# EAGLE design Dual Analogue Frequency Shifter (EAGLE 9.5.2)

## Sheet 1 of 3
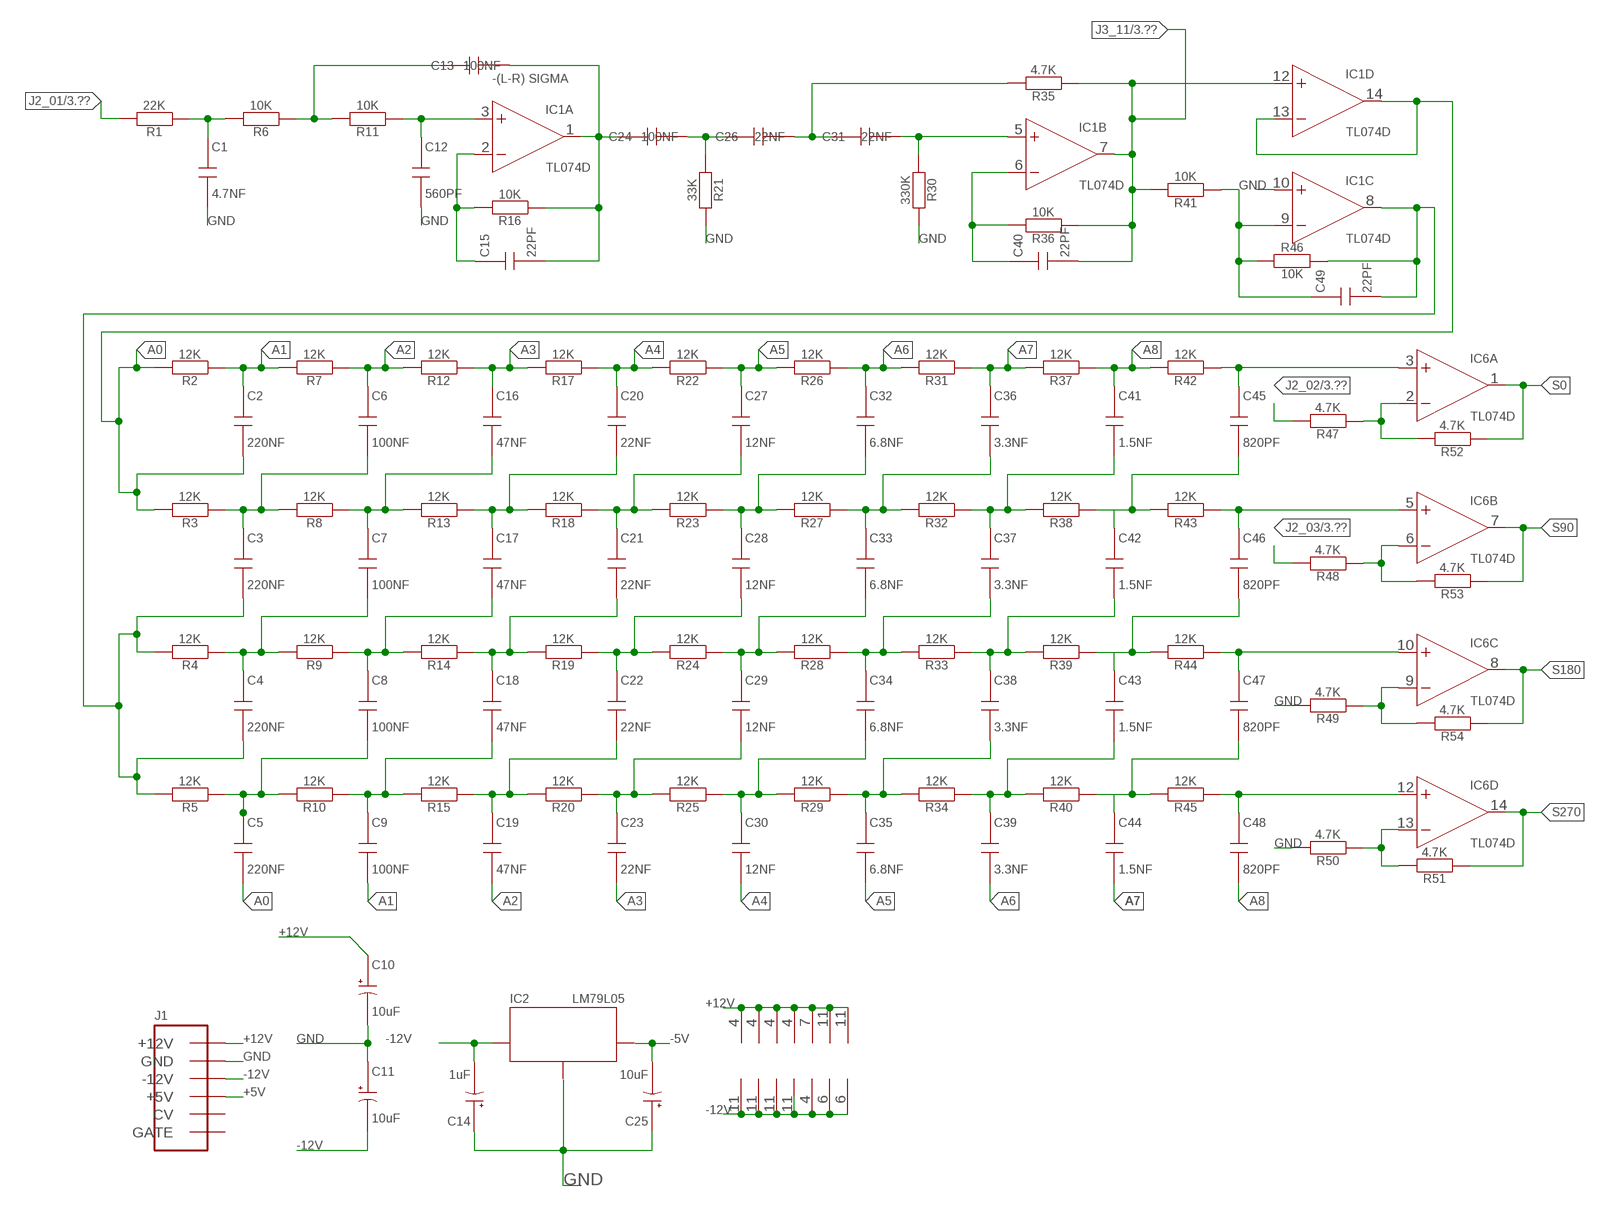
[diagram p0: schematic, sheet 1]

### Parts
C1  4.7NF  C  [CT6032]
C2  220NF  C  [CT6032]
C3  220NF  C  [CT6032]
C4  220NF  C  [CT6032]
C5  220NF  C  [CT6032]
C6  100NF  C  [CT6032]
C7  100NF  C  [CT6032]
C8  100NF  C  [CT6032]
C9  100NF  C  [CT6032]
C10  10uF  C+  [PANASONIC_E]
C11  10uF  C+  [PANASONIC_E]
C12  560PF  C  [CT6032]
C13  100NF  C  [CT6032]
C14  1uF  C+  [PANASONIC_E]
C15  22PF  C  [CT6032]
C16  47NF  C  [CT6032]
C17  47NF  C  [CT6032]
C18  47NF  C  [CT6032]
C19  47NF  C  [CT6032]
C20  22NF  C  [CT6032]
C21  22NF  C  [CT6032]
C22  22NF  C  [CT6032]
C23  22NF  C  [CT6032]
C24  100NF  C  [CT6032]
C25  10uF  C+  [PANASONIC_E]
C26  22NF  C  [CT6032]
C27  12NF  C  [CT6032]
C28  12NF  C  [CT6032]
C29  12NF  C  [CT6032]
C30  12NF  C  [CT6032]
C31  22NF  C  [CT6032]
C32  6.8NF  C  [CT6032]
C33  6.8NF  C  [CT6032]
C34  6.8NF  C  [CT6032]
C35  6.8NF  C  [CT6032]
C36  3.3NF  C  [CT6032]
C37  3.3NF  C  [CT6032]
C38  3.3NF  C  [CT6032]
C39  3.3NF  C  [CT6032]
C40  22PF  C  [CT6032]
C41  1.5NF  C  [CT6032]
C42  1.5NF  C  [CT6032]
C43  1.5NF  C  [CT6032]
C44  1.5NF  C  [CT6032]
C45  820PF  C  [CT6032]
C46  820PF  C  [CT6032]
C47  820PF  C  [CT6032]
C48  820PF  C  [CT6032]
C49  22PF  C  [CT6032]
IC1  TL074D  [SO14]
IC2  LM79L05  VREG  [SO08]
IC3  OPA4277U  [SO14]
IC4  TL074D  [SO14]
IC5  OP1177  [SO08]
IC6  TL074D  [SO14]
IC7  LM13700  [SO16]
IC8  LM13700  [SO16]
J1  EURO  [2X08SMT]
R1  22K  R  [R6332W]
R2  12K  R  [R6332W]
R3  12K  R  [R6332W]
R4  12K  R  [R6332W]
R5  12K  R  [R6332W]
R6  10K  R  [R6332W]
R7  12K  R  [R6332W]
R8  12K  R  [R6332W]
R9  12K  R  [R6332W]
R10  12K  R  [R6332W]
R11  10K  R  [R6332W]
R12  12K  R  [R6332W]
R13  12K  R  [R6332W]
R14  12K  R  [R6332W]
R15  12K  R  [R6332W]
R16  10K  R  [R6332W]
R17  12K  R  [R6332W]
R18  12K  R  [R6332W]
R19  12K  R  [R6332W]
R20  12K  R  [R6332W]
R21  33K  R  [R6332W]
R22  12K  R  [R6332W]
R23  12K  R  [R6332W]
R24  12K  R  [R6332W]
R25  12K  R  [R6332W]
R26  12K  R  [R6332W]
R27  12K  R  [R6332W]
R28  12K  R  [R6332W]
R29  12K  R  [R6332W]
R30  330K  R  [R6332W]
R31  12K  R  [R6332W]
R32  12K  R  [R6332W]
R33  12K  R  [R6332W]
R34  12K  R  [R6332W]
R35  4.7K  R  [R6332W]
R36  10K  R  [R6332W]
R37  12K  R  [R6332W]
R38  12K  R  [R6332W]
R39  12K  R  [R6332W]
R40  12K  R  [R6332W]
R41  10K  R  [R6332W]
R42  12K  R  [R6332W]
R43  12K  R  [R6332W]
R44  12K  R  [R6332W]
R45  12K  R  [R6332W]
R46  10K  R  [R6332W]
R47  4.7K  R  [R6332W]
R48  4.7K  R  [R6332W]
R49  4.7K  R  [R6332W]
R50  4.7K  R  [R6332W]
R51  4.7K  R  [R6332W]
R52  4.7K  R  [R6332W]
R53  4.7K  R  [R6332W]
R54  4.7K  R  [R6332W]

### Nets
+5V: J1.11(+5V) J1.12(+5V) ; also sheet 2,3
+12V: C10.+ IC1.4(P:V+) IC3.4(E:V+) IC4.4(P:V+) IC5.7(B:V+) IC6.4(P:V+) IC7.11(V+) IC8.11(V+) J1.9(+12V) J1.10(+12V) ; also sheet 3
-5V: C25.- IC2.1(OUT) ; also sheet 3
-12V: C11.- C14.- IC1.11(P:V-) IC2.8(IN) IC3.11(E:V-) IC4.11(P:V-) IC5.4(B:V-) IC6.11(P:V-) IC7.6(V-) IC8.6(V-) J1.1(-12V) J1.2(-12V) ; also sheet 3
A0: C2.- C5.- IC1.13(D:-IN) IC1.14(D:OUT) R2.2 R3.2
A1: C2.+ C9.- R2.1 R7.2
A2: C6.+ C19.- R7.1 R12.2
A3: C16.+ C23.- R12.1 R17.2
A4: C20.+ C30.- R17.1 R22.2
A5: C27.+ C35.- R22.1 R26.2
A6: C32.+ C39.- R26.1 R31.2
A7: C36.+ C44.- R31.1 R37.2
A8: C41.+ C48.- R37.1 R42.2
GND: C1.- C10.- C11.+ C12.- C14.+ C25.+ IC1.10(C:+IN) IC2.2(GND) IC2.3(GND) IC2.6(GND) IC2.7(GND) J1.3(GND) J1.4(GND) J1.5(GND) J1.6(GND) J1.7(GND) J1.8(GND) R21.2 R30.2 R49.2 R50.2 ; also sheet 2,3
J2_01: R1.2 ; also sheet 3
J2_02: R47.2 ; also sheet 3
J2_03: R48.2 ; also sheet 3
J3_11: C40.- IC1.7(B:OUT) IC1.12(D:+IN) R35.1 R36.1 R41.2 ; also sheet 3
N$6: C35.+ C38.- R29.1 R34.2
N$38: C3.+ C6.- R3.1 R8.2
N$39: C7.+ C16.- R8.1 R13.2
N$40: C17.+ C20.- R13.1 R18.2
N$41: C21.+ C27.- R18.1 R23.2
N$42: C28.+ C32.- R23.1 R27.2
N$43: C33.+ C36.- R27.1 R32.2
N$44: C37.+ C41.- R32.1 R38.2
N$45: C4.+ C7.- R4.1 R9.2
N$46: C8.+ C17.- R9.1 R14.2
N$47: C18.+ C21.- R14.1 R19.2
N$48: C22.+ C28.- R19.1 R24.2
N$49: C29.+ C33.- R24.1 R28.2
N$50: C34.+ C37.- R28.1 R33.2
N$51: C38.+ C42.- R33.1 R39.2
N$52: C5.+ C8.- R5.1 R10.2
N$53: C9.+ C18.- R10.1 R15.2
N$54: C19.+ C22.- R15.1 R20.2
N$55: C23.+ C29.- R20.1 R25.2
N$56: C30.+ C34.- R25.1 R29.2
N$58: C39.+ C43.- R34.1 R40.2
N$68: C1.+ R1.1 R6.2
N$69: C13.+ R6.1 R11.2
N$70: C12.+ IC1.3(A:+IN) R11.1
N$71: C31.- IC1.5(B:+IN) R30.1
N$72: C13.- C15.- C24.+ IC1.1(A:OUT) R16.1
N$73: C15.+ IC1.2(A:-IN) R16.2
N$74: C24.- C26.+ R21.1
N$75: IC6.2(A:-IN) R47.1 R52.2
N$77: C3.- C4.- C49.- IC1.8(C:OUT) R4.2 R5.2 R46.2
N$118: IC6.6(B:-IN) R48.1 R53.2
N$132: C49.+ IC1.9(C:-IN) R41.1 R46.1
N$153: C26.- C31.+ R35.2
N$154: C42.+ C45.- R38.1 R43.2
N$155: IC6.9(C:-IN) R49.1 R54.2
N$156: C43.+ C46.- R39.1 R44.2
N$157: IC6.13(D:-IN) R50.1 R51.2
N$158: C40.+ IC1.6(B:-IN) R36.2
N$159: C44.+ C47.- R40.1 R45.2
N$162: C45.+ IC6.3(A:+IN) R42.1
N$165: C46.+ IC6.5(B:+IN) R43.1
N$166: C48.+ IC6.12(D:+IN) R45.1
N$167: C47.+ IC6.10(C:+IN) R44.1
S0: IC6.1(A:OUT) R52.1
S90: IC6.7(B:OUT) R53.1
S180: IC6.8(C:OUT) R54.1
S270: IC6.14(D:OUT) R51.1
Unconnected: IC5.5(D:NC) IC5.8(E:NC) J1.13(CV) J1.14(CV) J1.15(GATE) J1.16(GATE)

### Notes on the sheet
- -(L-R) SIGMA

## Sheet 2 of 3
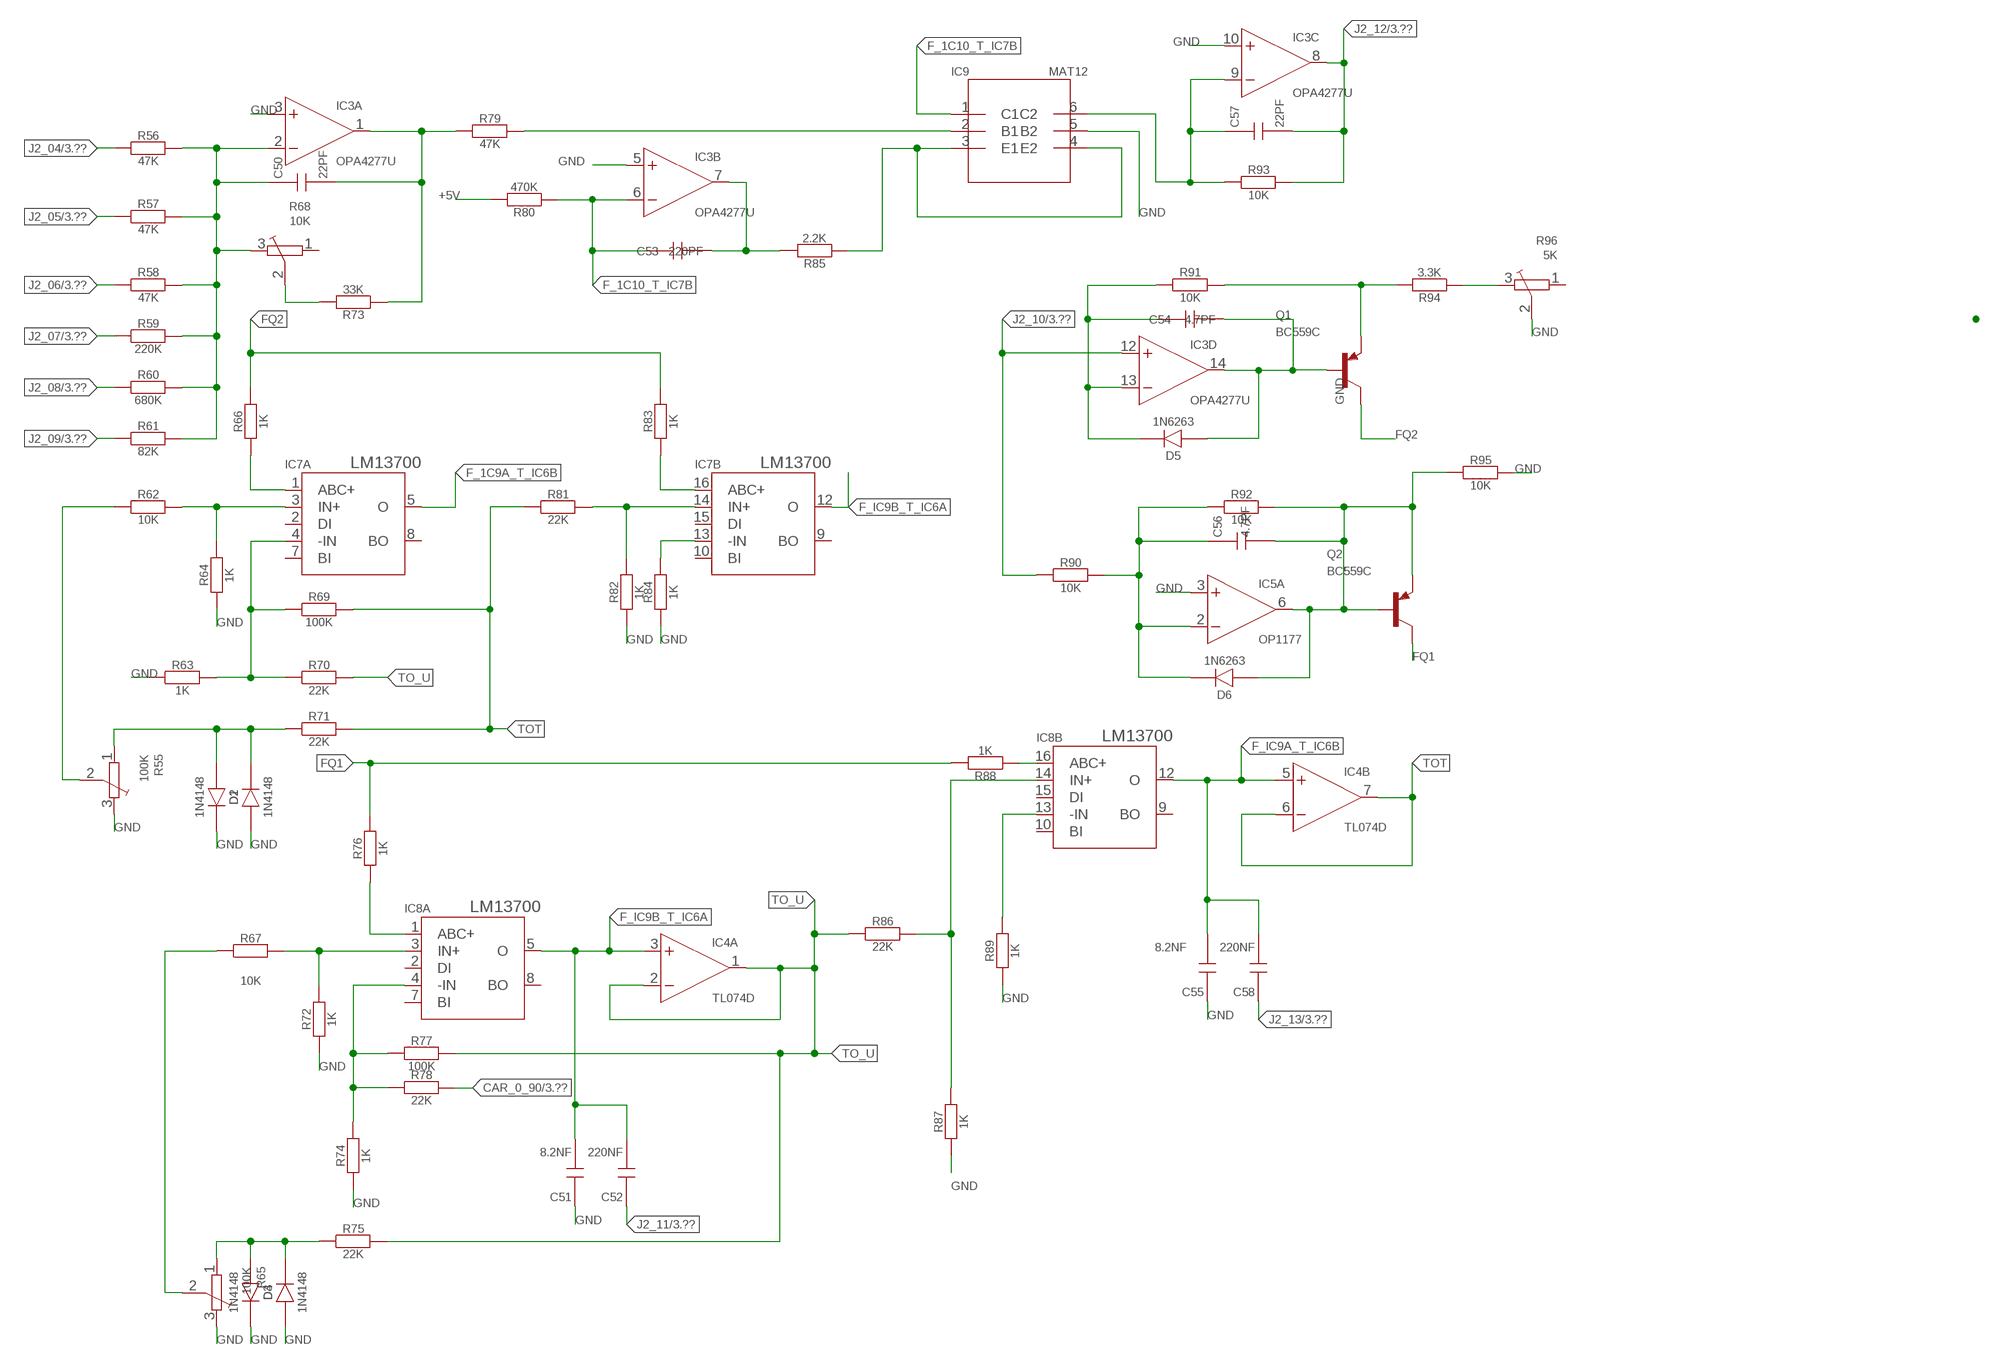
[diagram p1: schematic, sheet 2]

### Parts
C50  22PF  C  [CT6032]
C51  8.2NF  C  [CT6032]
C52  220NF  C  [CT6032]
C53  220PF  C  [CT6032]
C54  4.7PF  C  [CT6032]
C55  8.2NF  C  [CT6032]
C56  4.7PF  C  [CT6032]
C57  22PF  C  [CT6032]
C58  220NF  C  [CT6032]
D1  1N4148  D  [SOD123]
D2  1N4148  D  [SOD123]
D3  1N4148  D  [SOD123]
D4  1N4148  D  [SOD123]
D5  1N6263  D  [SOD123]
D6  1N6263  D  [SOD123]
IC9  MAT12  [H_6]
Q1  BC559C  [TO92]
Q2  BC559C  [TO92]
R55  100K  TRIM  [TRIM]
R56  47K  R  [R6332W]
R57  47K  R  [R6332W]
R58  47K  R  [R6332W]
R59  220K  R  [R6332W]
R60  680K  R  [R6332W]
R61  82K  R  [R6332W]
R62  10K  R  [R6332W]
R63  1K  R  [R6332W]
R64  1K  R  [R6332W]
R65  100K  TRIM  [TRIM]
R66  1K  R  [R6332W]
R67  10K  R  [R6332W]
R68  10K  TRIM  [TRIM]
R69  100K  R  [R6332W]
R70  22K  R  [R6332W]
R71  22K  R  [R6332W]
R72  1K  R  [R6332W]
R73  33K  R  [R6332W]
R74  1K  R  [R6332W]
R75  22K  R  [R6332W]
R76  1K  R  [R6332W]
R77  100K  R  [R6332W]
R78  22K  R  [R6332W]
R79  47K  R  [R6332W]
R80  470K  R  [R6332W]
R81  22K  R  [R6332W]
R82  1K  R  [R6332W]
R83  1K  R  [R6332W]
R84  1K  R  [R6332W]
R85  2.2K  R  [R6332W]
R86  22K  R  [R6332W]
R87  1K  R  [R6332W]
R88  1K  R  [R6332W]
R89  1K  R  [R6332W]
R90  10K  R  [R6332W]
R91  10K  R  [R6332W]
R92  10K  R  [R6332W]
R93  10K  R  [R6332W]
R94  3.3K  R  [R6332W]
R95  10K  R  [R6332W]
R96  5K  TRIM  [TRIM]

### Nets
+5V: R80.2 ; also sheet 1,3
CAR_0_90: R78.2 ; also sheet 3
F_1C9A_T_IC6B: IC7.5(A:O)
F_1C10_T_IC7B: C53.+ IC3.6(B:-IN) IC9.1(C1) R80.1
F_IC9A_T_IC6B: C55.- C58.- IC4.5(B:+IN) IC8.12(B:O)
F_IC9B_T_IC6A: C51.- C52.- IC4.3(A:+IN) IC7.12(B:O) IC8.5(A:O)
FQ1: Q2.C R76.2 R88.2
FQ2: Q1.C R66.2 R83.2
GND: C51.+ C55.+ D1.C D2.A D3.C D4.A IC3.3(A:+IN) IC3.5(B:+IN) IC3.10(C:+IN) IC5.3(A:+IN) IC9.5(B2) R55.3 R63.1 R64.1 R65.3 R72.1 R74.1 R82.1 R84.1 R87.1 R89.1 R95.2 R96.2 ; also sheet 1,3
J2_04: R56.1 ; also sheet 3
J2_05: R57.1 ; also sheet 3
J2_06: R58.1 ; also sheet 3
J2_07: R59.1 ; also sheet 3
J2_08: R60.1 ; also sheet 3
J2_09: R61.1 ; also sheet 3
J2_10: IC3.12(D:+IN) R90.1 ; also sheet 3
J2_11: C52.+ ; also sheet 3
J2_12: C57.- IC3.8(C:OUT) R93.2 ; also sheet 3
J2_13: C58.+ ; also sheet 3
N$3: R94.1 R96.3
N$64: IC9.3(E1) IC9.4(E2) R85.1
N$114: C50.+ IC3.2(A:-IN) R56.2 R57.2 R58.2 R59.2 R60.2 R61.2 R68.3
N$115: C50.- IC3.1(A:OUT) R73.1 R79.1
N$117: C53.- IC3.7(B:OUT) R85.2
N$119: IC9.2(B1) R79.2
N$120: C57.+ IC3.9(C:-IN) IC9.6(C2) R93.1
N$121: C54.+ D5.C IC3.13(D:-IN) R91.1
N$122: C54.- D5.A IC3.14(D:OUT) Q1.B
N$123: Q1.E R91.2 R94.2
N$124: C56.+ D6.C IC5.2(A:-IN) R90.2 R92.1
N$125: C56.- D6.A IC5.6(A:OUT) Q2.B Q2.E R92.2 R95.1
N$126: D3.A D4.C R65.1 R75.1
N$127: IC8.3(A:IN+) R67.2 R72.2
N$129: IC8.1(A:ABC+) R76.1
N$130: IC8.4(A:-IN) R74.2 R77.1 R78.1
N$134: IC8.16(B:ABC+) R88.1
N$135: IC8.14(B:IN+) R86.2 R87.2
N$137: IC8.13(B:-IN) R89.2
N$138: IC7.3(A:IN+) R62.2 R64.2
N$139: IC7.4(A:-IN) R63.2 R69.1 R70.1
N$141: IC7.1(A:ABC+) R66.1
N$142: IC7.16(B:ABC+) R83.1
N$144: IC7.13(B:-IN) R84.2
N$146: IC7.14(B:IN+) R81.2 R82.2
N$147: D1.A D2.C R55.1 R71.1
N$149: R68.2 R73.2
N$151: R65.2 R67.1
N$152: R55.2 R62.1
TO_U: IC4.1(A:OUT) IC4.2(A:-IN) R70.2 R75.2 R77.2 R86.1
TOT: IC4.6(B:-IN) IC4.7(B:OUT) R69.2 R71.2 R81.1
Unconnected: IC5.1(C:NC) IC7.2(A:DI) IC7.7(A:BI) IC7.8(A:BO) IC7.9(B:BO) IC7.10(B:BI) IC7.15(B:DI) IC8.2(A:DI) IC8.7(A:BI) IC8.8(A:BO) IC8.9(B:BO) IC8.10(B:BI) IC8.15(B:DI) R68.1 R96.1

## Sheet 3 of 3
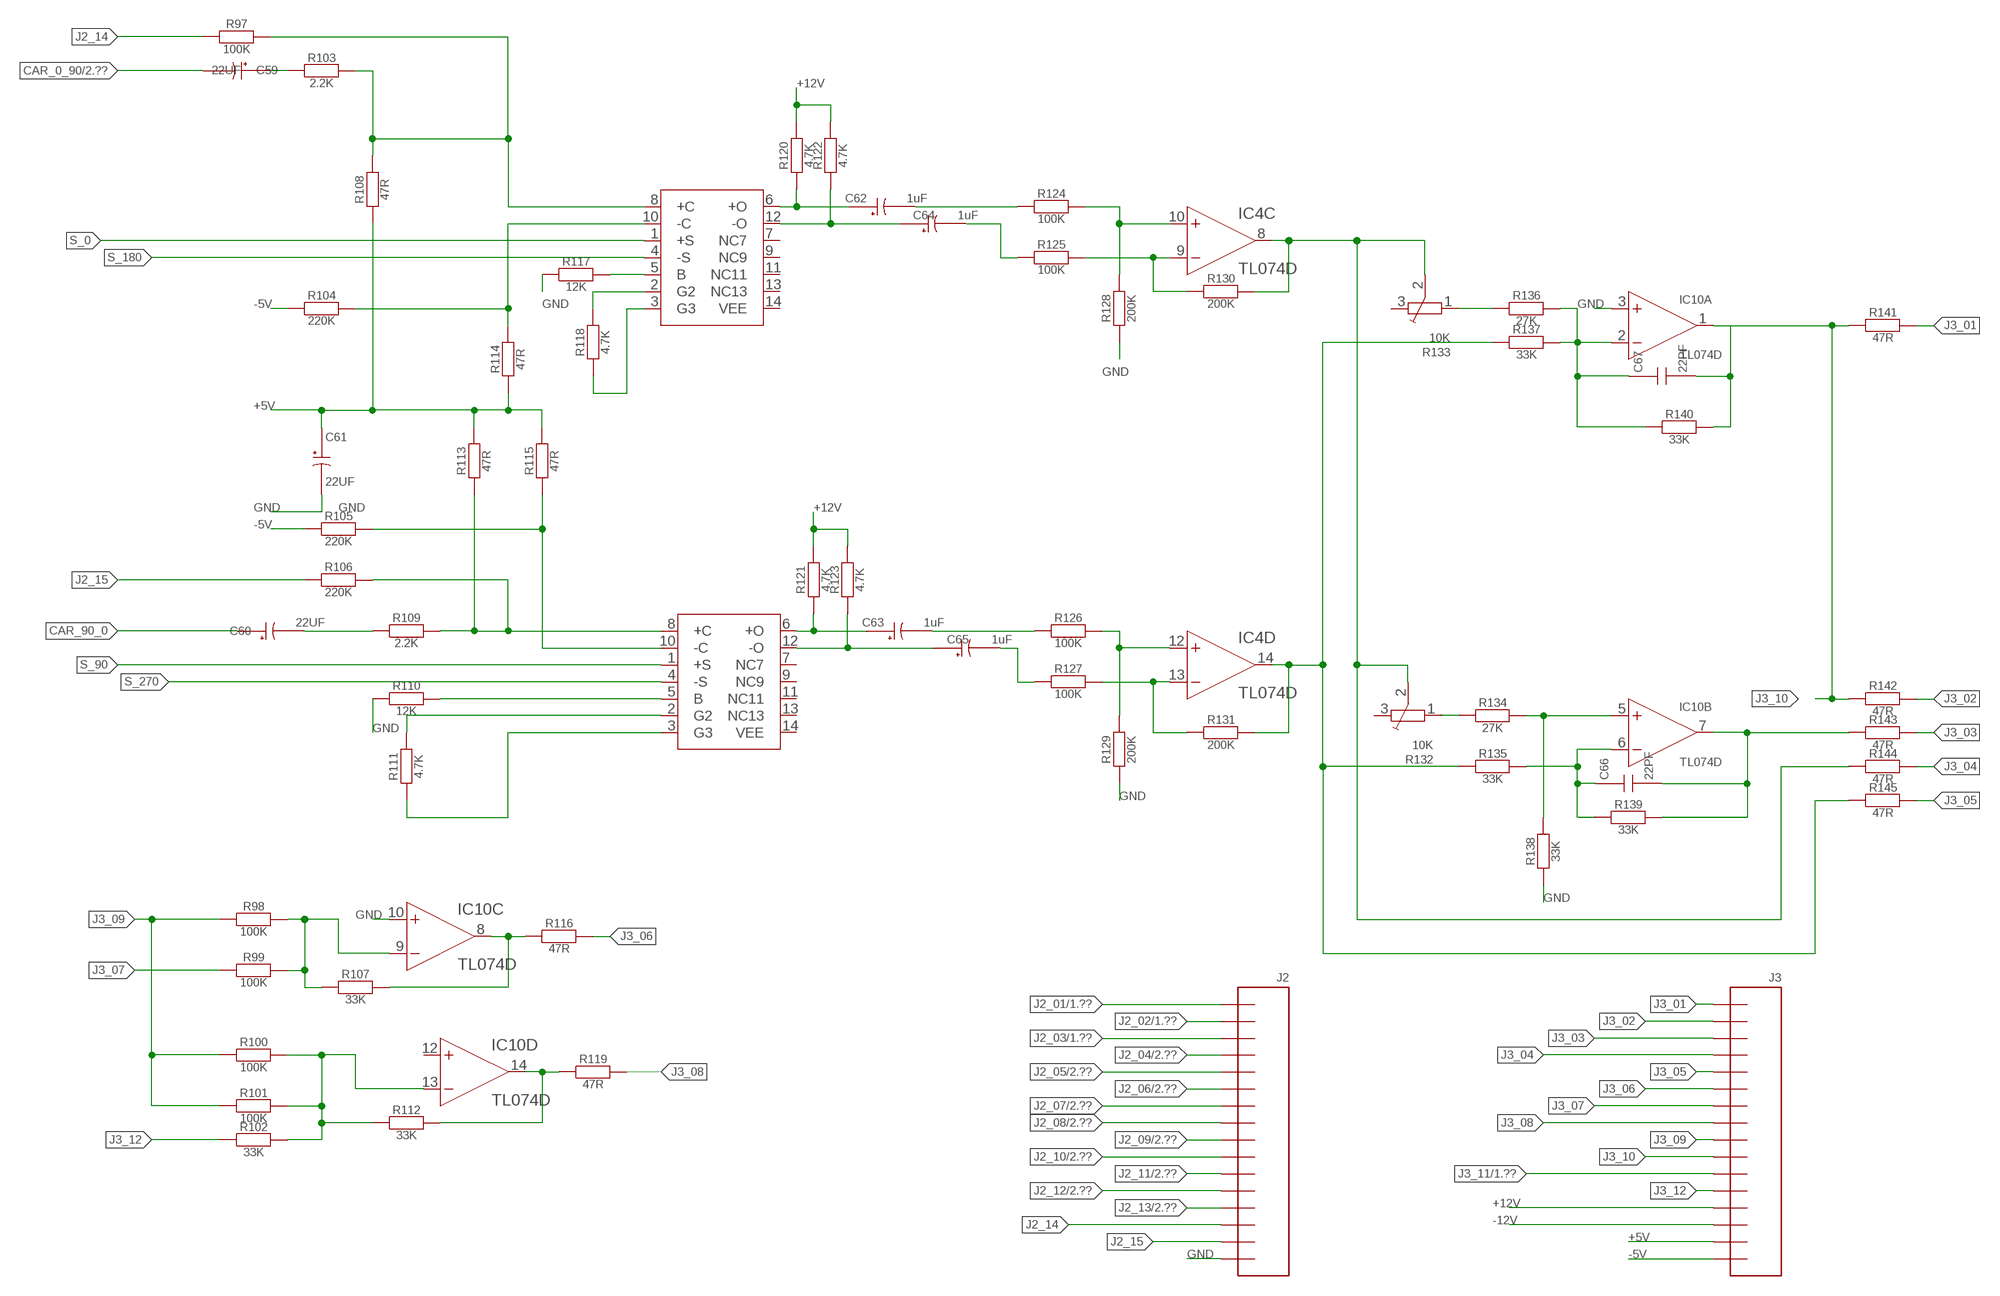
[diagram p2: schematic, sheet 3]

### Parts
C59  22UF  C+  [PANASONIC_E]
C60  22UF  C+  [PANASONIC_E]
C61  22UF  C+  [PANASONIC_E]
C62  1uF  C+  [PANASONIC_E]
C63  1uF  C+  [PANASONIC_E]
C64  1uF  C+  [PANASONIC_E]
C65  1uF  C+  [PANASONIC_E]
C66  22PF  C  [CT6032]
C67  22PF  C  [CT6032]
IC10  TL074D  [SO14]
J2  CON_16  [2X08SMT]
J3  CON_16  [2X08SMT]
R97  100K  R  [R6332W]
R98  100K  R  [R6332W]
R99  100K  R  [R6332W]
R100  100K  R  [R6332W]
R101  100K  R  [R6332W]
R102  33K  R  [R6332W]
R103  2.2K  R  [R6332W]
R104  220K  R  [R6332W]
R105  220K  R  [R6332W]
R106  220K  R  [R6332W]
R107  33K  R  [R6332W]
R108  47R  R  [R6332W]
R109  2.2K  R  [R6332W]
R110  12K  R  [R6332W]
R111  4.7K  R  [R6332W]
R112  33K  R  [R6332W]
R113  47R  R  [R6332W]
R114  47R  R  [R6332W]
R115  47R  R  [R6332W]
R116  47R  R  [R6332W]
R117  12K  R  [R6332W]
R118  4.7K  R  [R6332W]
R119  47R  R  [R6332W]
R120  4.7K  R  [R6332W]
R121  4.7K  R  [R6332W]
R122  4.7K  R  [R6332W]
R123  4.7K  R  [R6332W]
R124  100K  R  [R6332W]
R125  100K  R  [R6332W]
R126  100K  R  [R6332W]
R127  100K  R  [R6332W]
R128  200K  R  [R6332W]
R129  200K  R  [R6332W]
R130  200K  R  [R6332W]
R131  200K  R  [R6332W]
R132  10K  TRIM  [TRIM]
R133  10K  TRIM  [TRIM]
R134  27K  R  [R6332W]
R135  33K  R  [R6332W]
R136  27K  R  [R6332W]
R137  33K  R  [R6332W]
R138  33K  R  [R6332W]
R139  33K  R  [R6332W]
R140  33K  R  [R6332W]
R141  47R  R  [R6332W]
R142  47R  R  [R6332W]
R143  47R  R  [R6332W]
R144  47R  R  [R6332W]
R145  47R  R  [R6332W]
U1  MC1496  [SO14]
U2  MC1496  [SO14]

### Nets
+5V: C61.+ J3.15 R108.1 R113.2 R114.1 R115.2 ; also sheet 1,2
+12V: J3.13 R120.2 R121.2 R122.2 R123.2 ; also sheet 1
-5V: J3.16 R104.1 R105.1 ; also sheet 1
-12V: J3.14 ; also sheet 1
CAR_0_90: C59.- ; also sheet 2
CAR_90_0: C60.+
GND: C61.- IC10.3(A:+IN) IC10.10(C:+IN) J2.16 R110.1 R117.1 R128.1 R129.1 R138.1 ; also sheet 1,2
J2_01: J2.1 ; also sheet 1
J2_02: J2.2 ; also sheet 1
J2_03: J2.3 ; also sheet 1
J2_04: J2.4 ; also sheet 2
J2_05: J2.5 ; also sheet 2
J2_06: J2.6 ; also sheet 2
J2_07: J2.7 ; also sheet 2
J2_08: J2.8 ; also sheet 2
J2_09: J2.9 ; also sheet 2
J2_10: J2.10 ; also sheet 2
J2_11: J2.11 ; also sheet 2
J2_12: J2.12 ; also sheet 2
J2_13: J2.13 ; also sheet 2
J2_14: J2.14 R97.1
J2_15: J2.15 R106.1
J3_01: J3.1 R141.2
J3_02: J3.2 R142.2
J3_03: J3.3 R143.2
J3_04: J3.4 R144.2
J3_05: J3.5 R145.2
J3_06: J3.6 R116.2
J3_07: J3.7 R99.1
J3_08: J3.8 R119.2
J3_09: J3.9 R98.1 R100.1 R101.1
J3_10: C67.- IC10.1(A:OUT) J3.10 R140.2 R141.1 R142.1
J3_11: J3.11 ; also sheet 1
J3_12: J3.12 R102.1
J201: R132.1 R134.1
N$1: IC4.14(D:OUT) R131.2 R135.1 R137.1 R145.1
N$5: IC10.9(C:-IN) R98.2 R99.2 R107.1
N$7: IC10.8(C:OUT) R107.2 R116.1
N$8: IC10.13(D:-IN) R100.2 R101.2 R102.2 R112.1
N$9: IC10.14(D:OUT) R112.2 R119.1
N$175: R97.2 R103.2 R108.2 U1.8(+C)
N$177: C59.+ R103.1
N$178: R104.2 R114.2 U1.10(-C)
N$179: R105.2 R115.1 U2.10(-C)
N$180: C60.- R109.1
N$181: R106.2 R109.2 R113.1 U2.8(+C)
N$182: R110.2 U2.5(B)
N$183: R117.2 U1.5(B)
N$184: R118.2 U1.2(G2)
N$185: R111.2 U2.2(G2)
N$186: R111.1 U2.3(G3)
N$187: R118.1 U1.3(G3)
N$188: C62.+ R120.1 U1.6(+O)
N$189: C64.+ R122.1 U1.12(-O)
N$190: C62.- R124.1
N$191: C64.- R125.1
N$192: IC4.10(C:+IN) R124.2 R128.2
N$193: C63.+ R121.1 U2.6(+O)
N$194: C65.+ R123.1 U2.12(-O)
N$195: C63.- R126.1
N$196: C65.- R127.1
N$197: IC4.12(D:+IN) R126.2 R129.2
N$199: IC4.9(C:-IN) R125.2 R130.1
N$200: IC4.13(D:-IN) R127.2 R131.1
N$201: IC4.8(C:OUT) R130.2 R132.2 R133.2 R144.1
N$202: IC10.5(B:+IN) R134.2 R138.2
N$204: C67.+ IC10.2(A:-IN) R136.2 R137.2 R140.1
N$205: R133.1 R136.1
N$207: C66.+ IC10.6(B:-IN) R135.2 R139.1
N$208: C66.- IC10.7(B:OUT) R139.2 R143.1
S_0: U1.1(+S)
S_90: U2.1(+S)
S_180: U1.4(-S)
S_270: U2.4(-S)
Unconnected: IC10.12(D:+IN) R132.3 R133.3 U1.7(NC7) U1.9(NC9) U1.11(NC11) U1.13(NC13) U2.7(NC7) U2.9(NC9) U2.11(NC11) U2.13(NC13)

## Power pins joined to a net without a drawn wire
+12V: IC10.4(P:V+)
-12V: IC10.11(P:V-)
VEE: U1.14(VEE) U2.14(VEE)

## Library data of the parts
C1-C9 C12 C13 C15-C24 C26-C58 C66 C67 = SMD:C
C10 C11 C14 C25 C59-C65 = SMD:C+
D1-D6 = SMD:D
IC1 IC4 IC6 IC10 = SMD:TL074: OP AMP
IC2 = SMD:VREG
IC3 = SMD:OPA4277: High Precision OPERATIONAL AMPLIFIERS REPLACES OP-07, OP-77, OP-177 Source: opa277.pdf
IC5 = SMD:OP1177: Precision Low Noise, Low Input Bias Current Operational Amplifiers Source: OP1177_2177_4177.pdf
IC7 IC8 = SMD:LM13700
IC9 = SMD:MAT12; MANUFACTURER_PART_NUMBER: MAT12AHZ; VENDOR: Analog Devices Inc
J1 = SMD:EURO
J2 J3 = SMD:CON_16
Q1 Q2 = SMD:BC559: PNP Transistror
R1-R54 R56-R64 R66 R67 R69-R95 R97-R131 R134-R145 = SMD:R
R55 R65 R68 R96 R132 R133 = SMD:TRIM
U1 U2 = SMD:MC1496

## Board
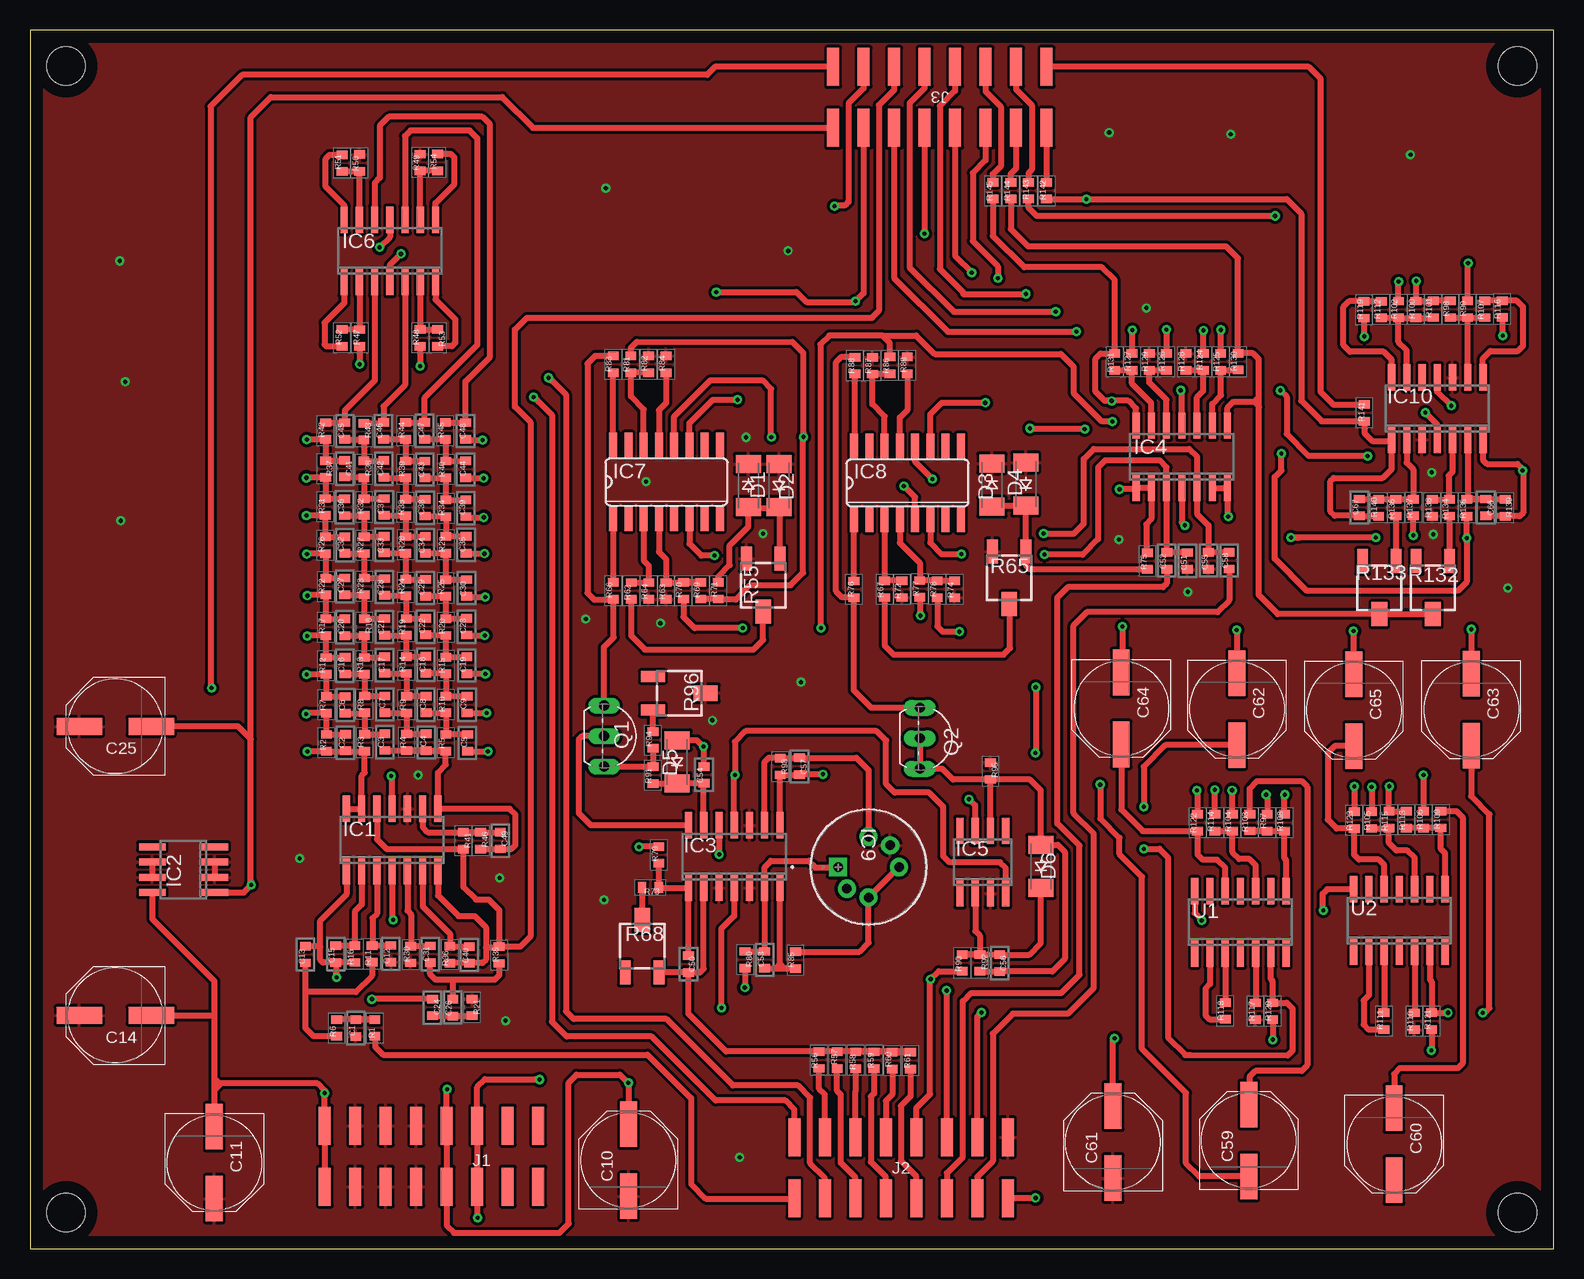
[diagram p3: board, top side]
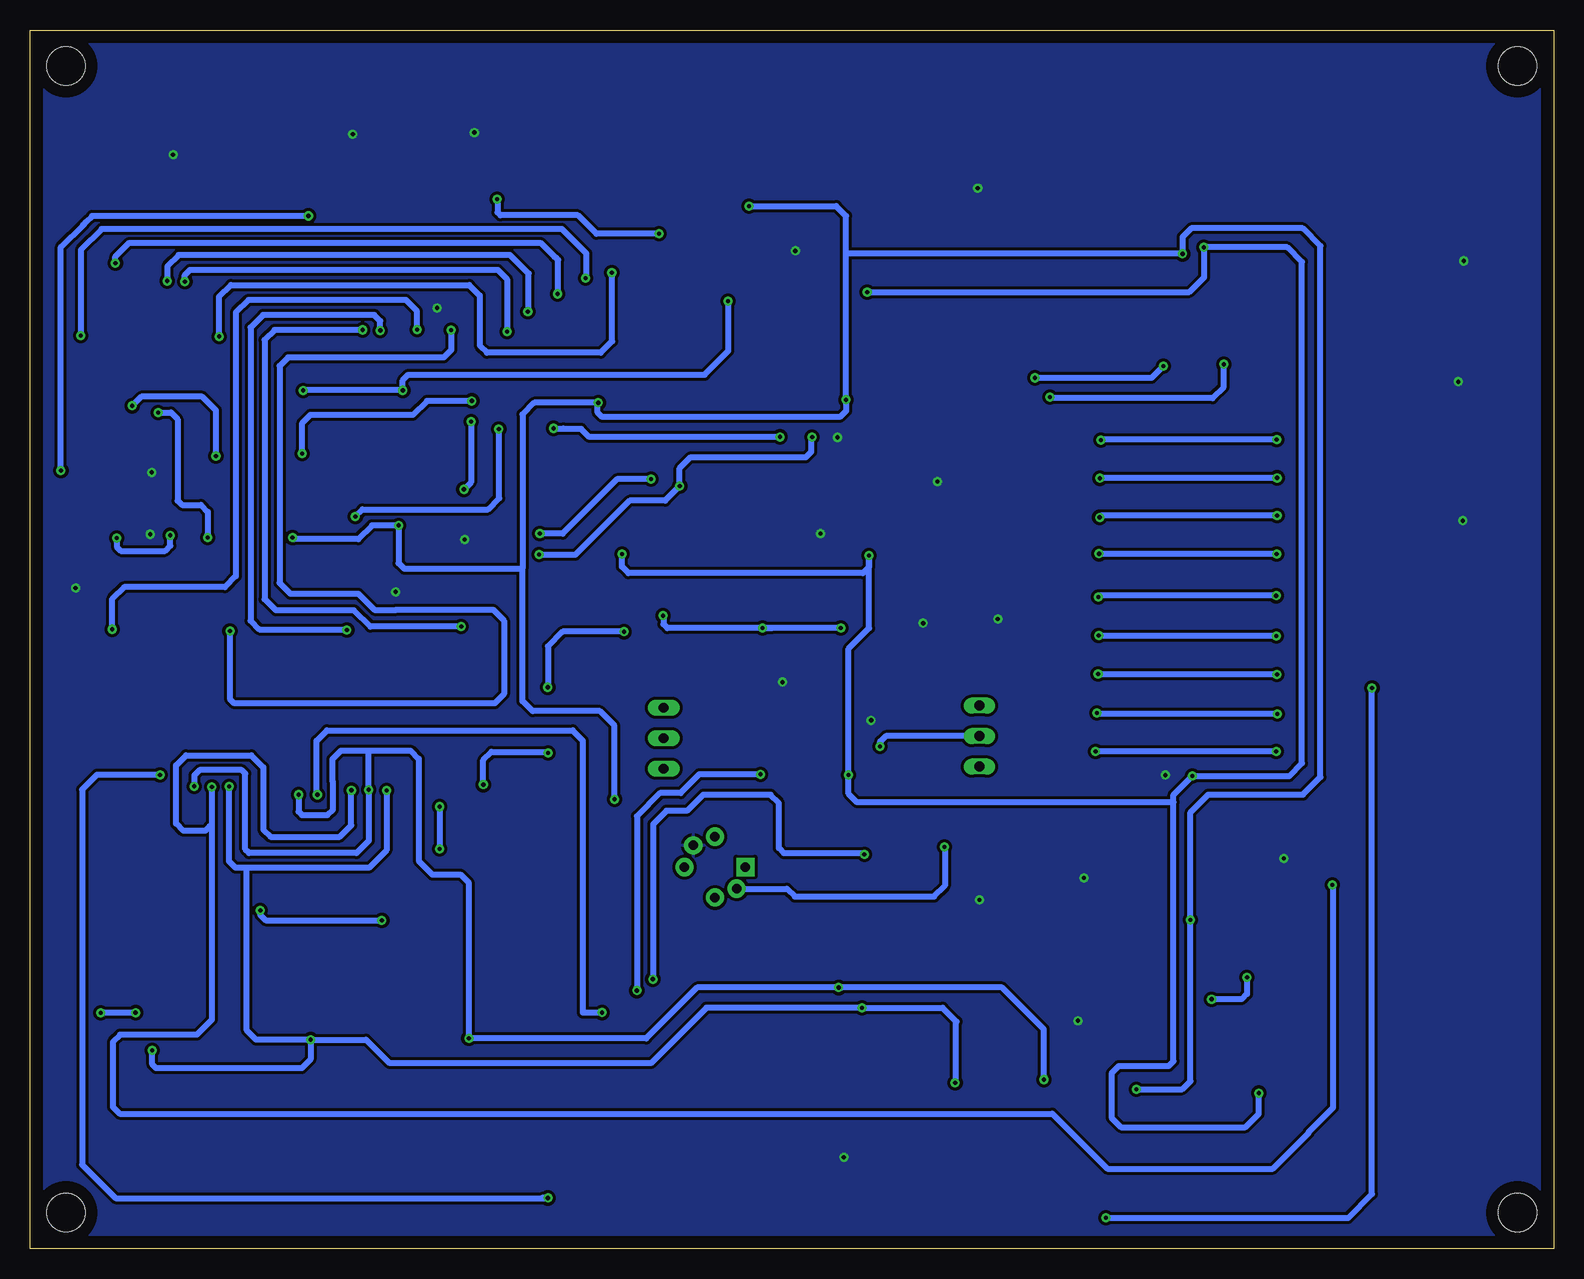
[diagram p4: board, bottom side, seen from below]

Size 127 x 101.6 mm. Coordinates in mm from the lower left corner, seen from the top.
Outline: 0,0 127,0 127,101.6 0,101.6 0,0
Copper layers (1*16): Top 0.035mm / dielectric 1.5mm / Bottom 0.035mm
Design rules "default *": minimum track width 6mil, minimum drill 0.35mm, track to track 10mil, track to pad 15mil, pad to pad 10mil, via to via 10mil, smd to smd 10mil, copper to edge 40mil, drill to drill 6mil, minimum pad ring 10mil, minimum via ring 8mil, stop-mask expansion 4mil, vias tented up to drill 0mil, thermal gap 10mil
Holes 3.2 mm at 3,3 3,98.6 124,98.6 124,3

### Footprints (pad centres in the part's own frame; a part is rotated, then mirrored left to right if it is on the bottom)
CT6032 = smd 0.7 x 0.9: + -0.7,0; - 0.7,0
PANASONIC_E = smd 3.8 x 1.4: + 3,0; - -3,0
SOD123 = smd 1.5 x 2.1: A 1.8,0; C -1.8,0
SO14 = smd 0.6 x 2.2: 1 -3.81,-2.6; 2 -2.54,-2.6; 3 -1.27,-2.6; 4 0,-2.6; 5 1.27,-2.6; 6 2.54,-2.6; 7 3.81,-2.6; 8 3.81,2.6; 9 2.54,2.6; 10 1.27,2.6; 11 0,2.6; 12 -1.27,2.6; 13 -2.54,2.6; 14 -3.81,2.6
SO08 = smd 0.6 x 2.2: 1 -1.905,-2.6; 2 -0.635,-2.6; 3 0.635,-2.6; 4 1.905,-2.6; 5 1.905,2.6; 6 0.635,2.6; 7 -0.635,2.6; 8 -1.905,2.6
SO16 = smd 0.66 x 2.032: 1 -4.445,-3.073; 2 -3.175,-3.073; 3 -1.905,-3.073; 4 -0.635,-3.073; 5 0.635,-3.073; 6 1.905,-3.073; 7 3.175,-3.073; 8 4.445,-3.073; 9 4.445,3.073; 10 3.175,3.073; 11 1.905,3.073; 12 0.635,3.073; 13 -0.635,3.073; 14 -1.905,3.073; 15 -3.175,3.073; 16 -4.445,3.073
H_6 = drill 0.787 pad 1.524 square: 1 0,-5.08 | drill 0.787 pad 1.524: 2 1.803,-4.343; 3 2.54,-2.54; 4 0,0; 5 -1.803,-0.737; 6 -2.54,-2.54
2X08SMT = smd 1 x 3.17: 1 -8.89,-2.54; 2 -8.89,2.54; 3 -6.35,-2.54; 4 -6.35,2.54; 5 -3.81,-2.54; 6 -3.81,2.54; 7 -1.27,-2.54; 8 -1.27,2.54; 9 1.27,-2.54; 10 1.27,2.54; 11 3.81,-2.54; 12 3.81,2.54; 13 6.35,-2.54; 14 6.35,2.54; 15 8.89,-2.54; 16 8.89,2.54
TO92 = drill 0.813 long: B 0,-1.27; C -2.54,-1.27; E 2.54,-1.27
R6332W = smd 0.7 x 0.9: 1 -0.7,0; 2 0.7,0
TRIM = smd 2 x 0.9: 1 -2.2,1.4; 3 -2.2,-1.4 | smd 2 x 1.3: 2 2.2,0

### Placement (x,y rotation side)
C1  27.16,18.4 270 top
C2  26.3,42.2 270 top
C3  29.59,42.24 270 top
C4  33.03,42.22 270 top
C5  36.47,42.17 270 top
C6  26.28,45.34 270 top
C7  29.59,45.38 270 top
C8  33.01,45.37 270 top
C9  36.44,45.36 270 top
C10  49.89,7.38 90 top
C11  15.36,7.17 270 top
C12  30.09,24.59 270 top
C13  22.96,24.53 90 top
C14  7.11,19.45 180 top
C15  25.49,24.56 270 top
C16  26.26,48.61 270 top
C17  29.56,48.66 270 top
C18  33,48.69 270 top
C19  36.41,48.64 270 top
C20  26.25,51.81 270 top
C21  29.55,51.84 270 top
C22  32.98,51.87 270 top
C23  36.39,51.86 270 top
C24  33.55,20.12 270 top
C25  7.11,43.55 180 top
C26  35.25,20.1 90 top
C27  26.24,55.21 270 top
C28  29.55,55.17 270 top
C29  32.97,55.1 270 top
C30  36.39,55.09 270 top
C31  33.37,24.55 90 top
C32  26.25,58.66 270 top
C33  29.52,58.7 270 top
C34  32.95,58.68 270 top
C35  36.35,58.69 270 top
C36  26.23,61.82 270 top
C37  29.52,61.84 270 top
C38  32.94,61.78 270 top
C39  36.34,61.74 270 top
C40  36.62,24.5 270 top
C41  26.24,65.04 270 top
C42  29.5,65.02 270 top
C43  32.91,64.96 270 top
C44  36.32,64.97 270 top
C45  26.24,68.17 270 top
C46  29.47,68.18 270 top
C47  32.9,68.19 270 top
C48  36.31,68.17 270 top
C49  39.2,34.03 270 top
C50  54.89,23.72 90 top
C51  96.48,57.34 90 top
C52  94.76,57.35 90 top
C53  61.24,24.09 270 top
C54  56.18,39.5 90 top
C55  98.24,57.35 90 top
C56  80.83,23.81 270 top
C57  64.14,40.22 270 top
C58  99.96,57.36 90 top
C59  101.6,9.02 90 top
C60  113.71,8.71 270 top
C61  90.28,8.89 90 top
C62  100.6,44.99 270 top
C63  120.14,44.94 270 top
C64  90.96,45.04 270 top
C65  110.35,44.9 270 top
C66  121.36,61.8 270 top
C67  110.81,61.8 270 top
D1  59.89,63.63 270 top
D2  62.43,63.62 90 top
D3  80.19,63.67 270 top
D4  83.01,63.75 90 top
D5  53.94,40.59 90 top
D6  84.27,31.87 90 top
IC1  30.19,34.08 0 top
IC2  12.8,31.6 90 top
IC3  58.7,32.7 0 top
IC4  96.01,66.02 0 top
IC5  79.43,32.23 0 top
IC6  30,83.18 0 top
IC7  53.06,63.93 0 top
IC8  73.15,63.85 0 top
IC9  72.44,31.82 270 top
IC10  117.31,70.04 0 top
J1  33.47,7.72 0 top
J2  72.61,6.75 0 top
J3  75.84,95.99 180 top
Q1  49.12,42.74 270 top
Q2  75.45,42.55 270 top
R1  28.75,18.41 270 top
R2  24.7,42.17 270 top
R3  27.9,42.19 270 top
R4  31.4,42.21 270 top
R5  34.66,42.17 270 top
R6  25.56,18.41 90 top
R7  24.7,45.35 270 top
R8  27.89,45.38 270 top
R9  31.39,45.36 270 top
R10  34.67,45.37 270 top
R11  28.51,24.58 270 top
R12  24.68,48.59 270 top
R13  27.88,48.59 270 top
R14  31.38,48.65 270 top
R15  34.67,48.62 270 top
R16  27.08,24.57 90 top
R17  24.66,51.81 270 top
R18  27.87,51.81 270 top
R19  31.37,51.84 270 top
R20  34.66,51.82 270 top
R21  36.85,20.12 90 top
R22  24.66,55.2 270 top
R23  27.87,55.21 270 top
R24  31.33,55.12 270 top
R25  34.65,55.08 270 top
R26  24.63,58.64 270 top
R27  27.86,58.65 270 top
R28  31.32,58.67 270 top
R29  34.66,58.68 270 top
R30  31.74,24.53 270 top
R31  24.61,61.84 270 top
R32  27.85,61.83 270 top
R33  31.3,61.79 270 top
R34  34.67,61.72 270 top
R35  39.11,24.49 270 top
R36  35,24.51 90 top
R37  24.64,65 270 top
R38  27.84,64.98 270 top
R39  31.3,64.96 270 top
R40  34.66,64.96 270 top
R41  36.12,34.02 270 top
R42  24.64,68.17 270 top
R43  27.84,68.12 270 top
R44  31.3,68.19 270 top
R45  34.63,68.18 270 top
R46  37.57,34.02 270 top
R47  27.49,75.92 270 top
R48  32.53,75.93 270 top
R49  32.52,90.55 90 top
R50  27.47,90.51 90 top
R51  26.01,90.5 270 top
R52  26.01,75.93 90 top
R53  33.99,75.94 90 top
R54  33.97,90.56 270 top
R55  61.12,55.32 270 top
R56  65.76,15.74 90 top
R57  67.29,15.72 90 top
R58  68.84,15.71 90 top
R59  70.36,15.71 90 top
R60  71.88,15.69 90 top
R61  73.4,15.69 90 top
R62  50.12,54.84 90 top
R63  53.02,54.84 90 top
R64  51.58,54.84 90 top
R65  81.63,55.94 270 top
R66  48.63,54.85 270 top
R67  71.24,54.99 90 top
R68  51.03,25.23 90 top
R69  55.91,54.86 270 top
R70  54.47,54.86 270 top
R71  57.38,54.86 270 top
R72  72.69,54.99 90 top
R73  51.72,30.12 180 top
R74  77.08,54.98 90 top
R75  93.15,57.33 90 top
R76  68.68,54.96 270 top
R77  74.17,55 270 top
R78  75.63,54.98 270 top
R79  52.42,32.83 90 top
R80  59.61,24.09 270 top
R81  50.09,73.72 270 top
R82  51.56,73.73 270 top
R83  48.62,73.72 90 top
R84  53.03,73.72 270 top
R85  63.81,24.06 270 top
R86  71.68,73.64 270 top
R87  70.22,73.61 270 top
R88  68.76,73.62 90 top
R89  73.13,73.64 270 top
R90  77.71,23.83 90 top
R91  51.93,39.48 90 top
R92  79.18,23.83 270 top
R93  62.54,40.2 270 top
R94  51.93,42.41 270 top
R95  80.06,39.82 90 top
R96  54.13,46.31 0 top
R97  103.13,35.52 270 top
R98  118.4,78.32 270 top
R99  119.84,78.32 270 top
R100  115.52,78.3 270 top
R101  116.97,78.32 270 top
R102  114.08,78.3 270 top
R103  101.68,35.53 270 top
R104  100.23,35.52 270 top
R105  111.84,35.74 270 top
R106  116.17,35.77 270 top
R107  121.28,78.32 90 top
R108  104.58,35.52 270 top
R109  117.61,35.78 270 top
R110  115.4,18.96 90 top
R111  112.86,18.98 270 top
R112  112.64,78.29 90 top
R113  114.73,35.77 90 top
R114  98.78,35.52 270 top
R115  113.29,35.76 90 top
R116  122.72,78.33 270 top
R117  102.15,19.8 90 top
R118  99.64,19.83 270 top
R119  111.19,78.28 270 top
R120  103.59,19.8 270 top
R121  116.84,18.97 270 top
R122  97.32,35.52 90 top
R123  110.39,35.73 90 top
R124  97.81,73.94 270 top
R125  99.25,73.94 270 top
R126  94.73,73.93 270 top
R127  91.86,73.93 270 top
R128  96.36,73.94 270 top
R129  93.3,73.93 270 top
R130  100.7,73.95 90 top
R131  90.42,73.93 90 top
R132  116.94,55.11 270 top
R133  112.48,55.11 270 top
R134  118.33,61.78 90 top
R135  119.78,61.77 90 top
R136  113.86,61.78 90 top
R137  115.32,61.79 90 top
R138  116.89,61.77 90 top
R139  122.97,61.76 270 top
R140  112.41,61.77 270 top
R141  111.23,69.68 90 top
R142  84.74,88.2 90 top
R143  83.24,88.2 90 top
R144  81.76,88.2 90 top
R145  80.27,88.2 90 top
U1  100.9,27.21 0 top
U2  114.15,27.36 0 top

### Tracks (layer width: path | path; a pad name or v marks a point on that pad's centre or on a via)
+5V  (via drill 0.35)
  Top 0.5: J3.15 57.1,98.53 56.44,97.87 17.69,97.87 15.05,95.23 15.05,46.83 | 42.12,14.13 37.92,14.13 37.28,13.49 J1.12 J1.11 37.28,2.61 v37.32,2.57 | 42.12,14.13 42.37,14.13 | v42.49,14.1 42.15,14.1 42.12,14.13 | R80.2 59.61,21.79 v59.59,21.77 | C61.+ 90.28,17.4 v90.41,17.53 | R113.2 R115.2 113.29,38.46 | 113.29,38.46 113.3,38.47 | R114.1 98.78,38.17 | 98.78,38.17 98.77,38.18 | R108.1 104.58,37.76 | 104.58,37.76 104.59,37.77 | v113.31,38.55 113.29,38.53 113.29,38.46 | v104.61,37.85 104.58,37.82 104.58,37.76 | v98.77,38.26 v98.78,38.25 98.78,38.17 | 15.05,46.83 15.12,46.76 | v15.13,46.74 15.05,46.82 15.05,46.83
  Bottom 0.5: v42.49,14.1 42.49,18.3 45.97,21.78 59.32,21.78 | 59.32,21.78 59.63,21.78 | 59.32,21.78 59.33,21.77 v59.59,21.77 71.39,21.77 75.63,17.53 v90.41,17.53 90.41,30.49 91.11,31.19 93.46,31.19 94.6,32.33 94.6,40.84 95.28,41.52 98.8,41.52 | v113.31,38.55 113.31,39.46 112.86,39.91 109.35,39.91 109.06,39.62 109.06,33.3 108.75,32.99 99.78,32.99 98.77,34 v98.77,38.26 98.77,41.49 98.8,41.52 | v104.61,37.85 104.61,36.45 104.32,36.16 102.19,36.16 101.75,36.6 101.75,38.93 101.78,38.96 101.78,40.82 101.08,41.52 98.8,41.52 | v15.13,46.74 15.13,4.56 17.12,2.57 v37.32,2.57
+12V  (via drill 0.35)
  Top 0.5: 49.89,13.78 C10.+ | 49.89,13.78 49.17,14.5 45.56,14.5 44.9,13.84 44.9,2.08 44.14,1.32 35.34,1.32 34.74,1.92 J1.9 J1.10 34.74,13.25 v34.78,13.29 | J3.13 69.49,96.74 68.23,95.48 68.23,87.27 67.92,86.96 67.1,86.96 v67.06,86.92 | IC1.4 30.19,27.47 v30.26,27.4 | 97.36,36.26 R122.2 97.32,38.16 v97.28,38.2 | v110.4,38.53 v110.39,38.52 R123.2 | R120.2 103.59,17.52 | 103.59,17.52 103.6,17.51 | v103.61,17.43 103.59,17.45 103.59,17.52 | R121.2 116.84,16.67 | 116.84,16.67 116.85,16.66 | v116.81,16.55 116.84,16.58 116.84,16.67 | IC7.11 54.97,68.81 56.92,70.77 v58.97,70.77 | IC8.11 75.06,69.58 75.98,70.5 79.57,70.5 79.59,70.52 v79.63,70.52 | IC4.4 96.01,60.57 v96.28,60.3 | IC5.7 78.8,36.95 v78.28,37.47 | IC6.4 30,82.02 v30.92,82.94 | IC3.4 58.7,27.73 57.62,26.65 57.62,20.21 | 57.62,20.21 57.66,20.17 | v57.65,20.08 57.62,20.11 57.62,20.21 | v49.88,13.83 v49.89,13.82 49.89,13.78 | IC10.4 117.31,68.71 v116.31,69.71 | v112.19,59.29 105.81,59.29 | 105.81,59.29 105.19,59.29 105.17,59.27 | v105.12,59.28 105.8,59.28 105.81,59.29
  Bottom 0.5: v103.61,17.43 103.61,15.78 104.34,15.05 116.5,15.05 116.81,15.36 v116.81,16.55 | v97.28,38.2 97.28,33.21 98.73,31.76 108.93,31.76 | 108.93,31.76 109.86,31.76 110.4,32.3 v110.4,38.53 | v103.61,17.43 108.16,17.43 108.93,18.2 108.93,31.76 | 58.97,82.88 v58.97,70.77 58.97,69.85 59.49,69.33 79.31,69.33 79.68,69.7 79.68,70.47 v79.63,70.52 84.97,70.52 85.94,69.55 85.94,56.72 | 58.97,82.88 58.97,86.09 59.8,86.92 v67.06,86.92 | 58.97,82.88 58.91,82.94 v30.92,82.94 30.92,84.34 30.2,85.06 20.91,85.06 19.43,83.58 19.43,39.31 20.88,37.86 28.79,37.86 30.26,36.39 v30.26,27.4 30.26,13.97 30.94,13.29 v34.78,13.29 | 49.85,13.86 49.85,18.84 49.77,18.92 50.93,20.08 v57.65,20.08 70.61,20.08 75.23,15.46 97.01,15.46 98.98,17.43 v103.61,17.43 | 49.85,13.86 49.85,13.85 | v49.88,13.83 49.85,13.86 | 85.94,56.72 85.97,56.69 95.81,56.69 96.28,57.16 v96.28,60.3 98.49,60.3 99.63,59.16 105,59.16 v105.12,59.28 | v78.28,37.47 78.28,43.61 79.48,44.81 85.09,44.81 85.94,45.66 85.94,56.72 | v116.31,69.71 115.24,69.71 114.69,69.16 114.69,62.36 114.33,62 112.75,62 112.17,61.42 112.17,59.59 | 112.17,59.59 112.17,59.17 | v112.19,59.29 112.19,59.57 112.17,59.59
-5V  (via drill 0.35)
  Top 0.5: IC2.1 17.82,29.7 18.4,30.27 18.4,30.62 | 18.4,30.62 18.4,42.49 | C25.- 17.34,43.55 18.4,42.49 | R104.1 100.23,38.2 | 100.23,38.2 100.23,38.21 | v111.84,38.49 R105.1 | v100.21,38.22 100.23,38.2 | 18.4,42.49 18.4,94.32 20.08,96 39.37,96 41.92,93.45 J3.16 | v18.44,30.33 18.44,30.58 18.4,30.62
  Bottom 0.5: v100.21,38.22 100.21,35.29 101.17,34.33 106.95,34.33 107.55,34.93 107.55,40.13 108.55,41.13 113.98,41.13 114.82,40.29 114.82,35.44 114.22,34.84 112.39,34.84 112.03,35.2 111.84,35.39 v111.84,38.49 111.84,19.08 113.09,17.83 119.49,17.83 120.09,17.23 120.09,11.81 119.53,11.25 41.78,11.25 37.2,6.67 23.39,6.67 20.41,9.65 20.41,9.73 18.39,11.75 18.39,30.34 18.4,30.33 v18.44,30.33
-12V  (via drill 0.35)
  Top 0.5: J1.1 J1.2 24.58,12.71 | 24.58,12.71 24.58,13.17 23.97,13.78 15.92,13.78 | 15.36,13.22 C11.- | 15.92,13.78 15.36,13.22 | 15.36,19.37 15.36,14.19 | 15.36,14.19 15.36,13.22 | 15.92,13.78 15.77,13.78 15.36,14.19 | IC2.8 10.2,27.48 15.36,22.32 15.36,19.37 | 15.36,19.37 15.28,19.45 C14.- | IC1.11 30.19,39.32 v30.1,39.41 | IC7.6 54.97,58.77 55.97,57.77 56.95,57.77 56.96,57.78 v57.06,57.78 | IC8.6 75.06,58.85 76.02,57.89 77.53,57.89 77.56,57.92 v77.65,57.92 | IC4.11 96.01,71.47 v95.92,71.56 | IC6.11 30,84.34 v29.14,83.48 | v24.56,12.97 24.56,12.73 24.58,12.71 | IC3.11 58.7,39.44 v58.76,39.5 58.76,42.26 59.66,43.16 70.58,43.16 71.36,42.38 71.36,38.74 72.07,38.03 74.94,38.03 76.14,36.83 76.14,32.72 76.65,32.21 80.86,32.21 81.33,31.73 IC5.4 | J3.14 69.49,79.66 v68.82,78.99 68.75,78.92 64.72,78.92 63.89,79.75 v57.21,79.75 | IC10.11 117.31,71.43 v118.47,70.27 | v104.24,71.55 104.76,71.03 104.76,67.94 106.58,66.12 111.45,66.12 | 111.45,66.12 111.55,66.12 | v111.5,66.07 111.45,66.12
  Bottom 0.5: v77.65,57.92 77.65,56.86 77.11,56.32 57.57,56.32 57.06,56.83 v57.06,57.78 57.06,51.73 58.76,50.03 v58.76,39.5 58.76,37.92 58.06,37.22 31.69,37.22 31.67,37.24 | 24.58,12.73 24.58,11.24 25.68,10.14 36.06,10.14 36.85,10.93 36.85,14.61 36.23,15.23 32.07,15.23 31.67,15.63 31.67,37.24 | 24.58,12.73 24.58,13.06 | v24.56,12.97 24.56,12.75 24.58,12.73 | 31.67,37.24 31.67,37.84 v30.1,39.41 22.04,39.41 20.97,40.48 20.97,82.26 22.19,83.48 v29.14,83.48 29.14,80.97 30.36,79.75 v57.21,79.75 | v68.82,78.99 68.82,78.95 68.81,78.94 68.81,74.83 70.77,72.87 95.46,72.87 95.92,72.41 v95.92,71.56 v104.23,71.56 v104.24,71.55 104.26,71.53 | v111.5,66.07 111.5,69.89 112.64,71.03 117.71,71.03 v118.47,70.27
A0  (via drill 0.35)
  Top 0.5: IC1.14 IC1.13 27.65,39.45 27.9,39.7 R3.2 27.88,41.47 26.33,41.47 | 26.33,41.47 R2.2 v23.13,41.47 v23.12,41.46 | C5.- v38.16,41.47 v38.17,41.46 | C2.- 26.33,41.47
  Bottom 0.5: v23.12,41.46 v38.17,41.46
A1  (via drill 0.35)
  Top 0.5: C2.+ 26.27,42.87 R2.1 R7.2 23.09,44.65 v23.03,44.59 | C9.- v38.06,44.66 v38.07,44.67
  Bottom 0.5: v23.03,44.59 37.99,44.59 v38.07,44.67
A2  (via drill 0.35)
  Top 0.5: C6.+ R7.1 24.68,46.07 R12.2 v23.06,47.89 v23.05,47.88 | C19.- 37.94,47.94 v37.96,47.92
  Bottom 0.5: v23.05,47.88 37.92,47.88 v37.96,47.92
A3  (via drill 0.35)
  Top 0.5: C16.+ 26.24,49.29 R12.1 24.66,49.31 R17.2 23.13,51.11 v23.1,51.08 | C23.- 36.43,51.12 v37.91,51.12
  Bottom 0.5: v23.1,51.08 37.87,51.08 v37.91,51.12
A4  (via drill 0.35)
  Top 0.5: C20.+ R17.1 R22.2 23.18,54.5 v23.12,54.44 | C30.- 36.46,54.32 v37.95,54.32
  Bottom 0.5: v23.12,54.44 37.83,54.44 v37.95,54.32
A5  (via drill 0.35)
  Top 0.5: C27.+ R22.1 24.63,55.93 R26.2 23.1,57.94 v23.08,57.92 | C35.- 36.4,57.94 v37.88,57.94
  Bottom 0.5: v23.08,57.92 37.86,57.92 v37.88,57.94
A6  (via drill 0.35)
  Top 0.5: C32.+ 26.23,59.34 R26.1 24.61,59.36 R31.2 v23.05,61.14 v23.04,61.13 | C39.- 36.41,60.97 v37.83,60.97
  Bottom 0.5: v23.04,61.13 37.67,61.13 v37.83,60.97
A7  (via drill 0.35)
  Top 0.5: C36.+ 26.21,62.54 R31.1 24.64,62.57 R37.2 23.08,64.3 v23.04,64.26 | C44.- 36.36,64.23 v37.81,64.23
  Bottom 0.5: v23.04,64.26 37.78,64.26 v37.81,64.23
A8  (via drill 0.35)
  Top 0.5: C41.+ 26.2,65.7 R37.1 R42.2 v23.09,67.47 v23.08,67.46 | C48.- 36.37,67.41 v37.72,67.41
  Bottom 0.5: v23.08,67.46 37.67,67.46 v37.72,67.41
CAR_0_90  (via drill 0.35)
  Top 0.5: v77.48,51.44 76.07,51.44 75.63,51.88 R78.2 | C59.- 97.46,6.02 96.37,7.11 96.37,12.98 92.7,16.65 92.7,31.01 90.83,32.88 90.83,34.25 89.21,35.87 v89.21,38.69 | v83.84,46.81 83.84,41.35 v83.81,41.32
  Bottom 0.5: v89.21,38.69 89.21,40.74 88.53,41.42 83.91,41.42 | 83.91,41.42 83.82,41.42 | v77.48,51.44 82.6,51.44 83.83,50.21 83.83,46.88 | 83.83,46.88 83.79,46.84 | v83.84,46.81 v83.83,46.82 83.83,46.88 | v83.81,41.32 83.91,41.42
F_1C10_T_IC7B
  Top 0.5: R80.1 C53.+ IC3.6 61.24,31.8 61.77,32.33 64.91,32.33 65.47,31.77 67.31,31.77 IC9.1
F_IC9A_T_IC6B  (via drill 0.35)
  Top 0.5: C58.- C55.- 98.24,60.3 97.28,61.26 IC4.5 97.28,66.02 96.62,66.68 88.68,66.68 87.85,65.85 87.85,60.45 87.02,59.62 84.54,59.62 | 84.54,59.62 84.5,59.66 | IC8.12 73.78,65.61 v75.24,64.15 | v84.5,59.62 84.54,59.62
  Bottom 0.5: v75.24,64.15 78.07,64.15 82.6,59.62 v84.5,59.62
F_IC9B_T_IC6A  (via drill 0.35)
  Top 0.5: C51.- C52.- 94.74,58.07 IC4.3 94.74,65.14 94.17,65.71 89.62,65.71 89.04,65.13 89.04,59.15 87.76,57.87 v84.56,57.87 | IC7.12 53.7,69.39 56.71,72.4 61.05,72.4 61.78,71.67 61.78,67.68 v61.8,67.66 | IC8.5 73.78,62.65 v72.84,63.59
  Bottom 0.5: v61.8,67.66 61.87,67.59 61.87,66.44 62.33,65.98 71.92,65.98 72.84,65.06 v72.84,63.59 74.06,62.37 77.02,62.37 81.53,57.86 84.58,57.86 v84.57,57.87 v84.56,57.87
FQ1
  Top 0.5: Q2.C 70.13,45.09 68.68,46.54 R76.2 68.65,54.29 67.7,54.29 67.2,54.79 67.2,73.92 67.6,74.32 R88.2
FQ2
  Top 0.5: Q1.C 47.85,50.15 48.66,50.96 48.66,54.12 | 48.66,54.12 R66.2 | R83.2 47.11,74.42 46.47,73.78 46.47,54.68 47.03,54.12 48.66,54.12
GND  (via drill 0.35)
  Top 0.5: IC2.6 IC2.7 | IC2.3 IC2.2
  other vias: 93.07,78.43 52.55,52.15 56.88,44.05 32.36,39.48 39.65,19.01 96.53,54.76 116.85,64.72 116.97,59.56 90.78,59.12 61.1,59.61 59.68,67.64 89.96,93.05 100.09,92.91 48,88.41 63.2,83.19 115.08,91.2 7.47,82.35 7.94,72.27 7.56,60.69 47.86,29.07 39.14,30.92 22.49,32.54 59.16,7.62 64.28,47.23 51.35,63.95 46.33,52.49 123.2,55.07
  pour Top: 0,101.6 127,101.6 127,0 0,0
  pour Bottom: 0,101.6 127,101.6 127,0 0,0
J2_01
  Top 0.5: J2.1 63.69,4.18 56.33,4.18 55.11,5.4 55.11,12.54 51.47,16.18 29.42,16.18 28.79,16.81 28.79,17.67 R1.2
J2_02  (via drill 0.35)
  Top 0.5: J2.2 63.72,11.6 62.96,12.36 57.15,12.36 51.82,17.69 44.74,17.69 43.51,18.93 43.51,69.5 42.41,70.61 | R47.2 v27.49,73.73 | 42.11,70.9 42.41,70.61 | v41.99,70.99 42.38,70.61 42.41,70.61
  Bottom 0.5: v27.49,73.73 27.49,71.84 28.43,70.9 41.9,70.9 v41.99,70.99
J2_03  (via drill 0.35)
  Top 0.5: J2.3 66.26,5.91 65.03,7.14 65.03,12.6 64.01,13.62 58.6,13.62 53.06,19.16 45.32,19.16 44.67,19.8 44.67,71.2 43.52,72.36 | R48.2 v32.53,73.59 | 43.32,72.56 43.52,72.36 | v43.23,72.6 43.48,72.36 43.52,72.36
  Bottom 0.5: v43.23,72.6 33.52,72.6 v32.53,73.59
J2_04
  Top 0.5: J2.4 66.26,12.86 65.78,13.34 65.78,15.02 R56.1
J2_05
  Top 0.5: J2.5 68.8,5.94 67.59,7.15 67.59,12.85 67.29,13.15 R57.1
J2_06
  Top 0.5: J2.6 68.8,13.1 68.85,13.15 R58.1
J2_07
  Top 0.5: J2.7 71.34,5.99 70.1,7.23 70.1,12.69 70.36,12.95 R59.1
J2_08
  Top 0.5: J2.8 71.34,12.32 71.88,12.86 R60.1
J2_09
  Top 0.5: J2.9 73.88,6.02 72.59,7.31 72.59,11.9 73.4,12.71 R61.1
J2_10  (via drill 0.35)
  Top 0.5: J2.10 73.88,11.73 75.03,12.88 75.03,22.24 75.03,22.4 | R90.1 75.76,23.13 75.03,22.4 | IC3.12 57.43,32.98 57.45,32.96 v57.45,32.87 | v75.08,22.47 75.03,22.42 75.03,22.4
  Bottom 0.5: v57.45,32.87 57.55,32.97 64.15,32.97 64.58,33.4 64.58,37.16 65.27,37.85 70.89,37.85 72.24,36.5 73.95,36.5 75.04,35.41 75.04,22.49 75.06,22.49 v75.08,22.47
J2_11
  Top 0.5: C52.+ 94.76,55.46 94.45,55.15 86.52,55.15 85.64,54.27 85.64,35.45 87.48,33.61 87.48,22.84 85.96,21.32 78.44,21.32 77.76,20.64 77.76,7.63 76.42,6.29 J2.11
J2_12  (via drill 0.35)
  Top 0.5: IC3.8 62.51,39.47 R93.2 64.12,39.5 C57.- 66.07,39.52 v66.1,39.55 | J2.12 76.42,21.01 | 76.42,21.01 76.42,21.43 | v76.41,21.52 76.41,21.02 76.42,21.01
  Bottom 0.5: v76.41,21.52 76.41,36.05 74.48,37.98 72.77,37.98 71.21,39.54 66.22,39.54 | 66.22,39.54 66.2,39.52 | v66.1,39.55 v66.11,39.54 66.22,39.54
J2_13
  Top 0.5: J2.13 78.96,5.99 80.27,7.3 80.27,17.93 81.93,19.59 86.53,19.59 88.67,21.73 88.67,34.61 86.99,36.29 86.99,51.97 88.09,53.07 98.99,53.07 99.96,54.04 C58.+
J2_14  (via drill 0.35)
  Top 0.5: J2.14 78.96,19.35 | 78.96,19.35 79.23,19.62 | v79.32,19.69 78.98,19.35 78.96,19.35 | R97.1 103.13,37.76 v103.04,37.85
  Bottom 0.5: v79.32,19.69 80.92,19.69 80.92,42.36 81.77,43.21 102.23,43.21 103.11,42.33 103.11,37.82 103.08,37.85 v103.04,37.85
J2_15  (via drill 0.35)
  Top 0.5: R106.1 116.17,39.38 | 116.17,39.38 116.19,39.4 | v116.16,39.5 v116.17,39.49 116.17,39.38 | v83.83,4.23 83.81,4.21 J2.15
  Bottom 0.5: v116.16,39.5 121.42,39.5 122.65,38.27 122.65,7.01 119.86,4.22 84.34,4.22 | 84.34,4.22 83.96,4.22 | v83.83,4.23 84.33,4.23 84.34,4.22
J3_01
  Top 0.5: J3.1 106.6,98.53 107.6,97.53 107.6,71.43 108.69,70.34 111.19,70.34 R141.2
J3_02
  Top 0.5: J3.2 R142.2
J3_03
  Top 0.5: J3.3 82.19,96.65 83.51,95.33 83.51,89.94 83.24,89.67 R143.2
J3_04
  Top 0.5: R144.2 81.73,88.93 81.73,89.59 82.19,90.05 J3.4
J3_05
  Top 0.5: J3.5 79.65,96.48 80.92,95.21 80.92,90.23 80.27,89.58 R145.2
J3_06  (via drill 0.35)
  Top 0.5: J3.6 79.65,90.73 78.59,89.67 78.59,84 80.68,81.91 v80.68,80.91 | R116.2 122.72,76.16 | 122.72,76.16 122.72,76.11 122.73,76.1 | v122.76,76.12 122.72,76.16
  Bottom 0.5: v80.68,80.91 80.62,80.91 80.61,80.92 80.61,82.97 82.65,85.01 121.03,85.01 122.76,83.28 v122.76,76.12
J3_07  (via drill 0.35)
  Top 0.5: J3.7 77.11,96.52 75.85,95.26 75.85,81.68 77.79,79.74 77.79,79.6 v83.02,79.6 | R99.1 119.84,82.13 | 119.84,82.13 119.83,82.14 | v119.88,82.16 119.85,82.13 119.84,82.13
  Bottom 0.5: 82.97,79.69 83.02,79.64 | v83.02,79.6 82.97,79.65 82.97,79.69 | v119.88,82.16 119.88,82.71 118.72,83.87 84.45,83.87 83.28,82.69 83.25,82.69 82.97,82.42 82.97,79.69
J3_08  (via drill 0.35)
  Top 0.5: R119.2 111.19,76.13 | 111.19,76.13 111.2,76.12 | v111.23,76.05 111.19,76.09 111.19,76.13 | J3.8 77.11,82.75 v78.5,81.36
  Bottom 0.5: 78.47,81.33 78.47,75.65 79.43,74.69 88.91,74.69 89.51,75.29 89.51,79.47 90.38,80.34 110.25,80.34 111.23,79.36 v111.23,76.05 | 78.47,81.33 78.47,81.43 | v78.5,81.36 78.47,81.33
J3_09  (via drill 0.35)
  Top 0.5: R98.1 R101.1 116.95,79 R100.1 115.52,80.69 v115.55,80.69 v115.56,80.68 | J3.9 74.57,96.76 73.32,95.51 73.32,81.79 77,78.11 v85.5,78.11
  Bottom 0.5: 85.43,78.2 85.42,78.19 | v85.5,78.11 85.43,78.18 85.43,78.2 | 85.43,78.2 85.43,81.3 86.98,82.85 114.61,82.85 115.56,81.9 v115.56,80.68
J3_10  (via drill 0.35)
  Top 0.5: R140.2 110.84,61.07 C67.- 108.76,61.1 108.41,61.45 108.41,63.99 108.67,64.25 112.76,64.25 113.5,64.99 IC10.1 113.41,67.35 111.88,67.35 111.23,68 R141.1 107.68,68.98 105.96,70.7 105.96,86.29 104.75,87.5 v88.06,87.5 R142.1 | J3.10 74.57,84.66 | 74.57,84.66 74.55,84.64 | v74.56,84.62 v74.57,84.63 74.57,84.66
  Bottom 0.5: v74.56,84.62 79.79,84.62 81.31,86.14 87.78,86.14 88.04,86.4 88.04,87.48 | 88.04,87.54 88.04,87.48 | v88.06,87.5 88.04,87.48
J3_11
  Top 0.5: IC1.7 34,29.45 35.72,27.73 37.07,27.73 38.01,26.79 38.01,25.09 | C40.- R36.1 | 38.01,25.09 38.01,24.1 37.72,23.81 C40.- | R35.1 39.01,25.09 38.01,25.09 | IC1.12 28.92,34.13 29.73,33.32 R41.2 36.12,30.16 37.17,29.11 38.24,29.11 39.11,28.24 R35.1 | J3.11 72.03,96.6 70.77,95.34 70.77,78.2 70.19,77.62 41.42,77.62 40.43,76.63 40.43,70.19 41.73,68.89 41.73,26.02 40.89,25.19 R35.1 | C40.-
J3_12  (via drill 0.35)
  Top 0.5: J3.12 72.03,80.92 76.5,76.45 v87.24,76.45 | R102.1 v114.08,80.62 | v114.08,80.62 v114.08,80.63 | v114.09,80.63 v114.08,80.62
  Bottom 0.5: v114.09,80.63 114.09,81.17 113.65,81.61 88.01,81.61 87.24,80.84 v87.24,76.45
J201
  Top 0.5: R134.1 R132.1
N$1  (via drill 0.35)
  Top 0.5: R145.1 80.27,84.43 82.88,81.82 89.37,81.82 90.42,80.77 R131.2 89.23,74.63 88.82,74.22 88.82,71.45 89.58,70.69 | IC4.14 92.2,70.04 91.55,70.69 89.58,70.69 | v115.31,59.47 v115.32,59.48 R137.1 | R135.1 v119.78,59.25 v119.77,59.24 119.77,55.59 119.01,54.83 106.45,54.83 103.76,57.52 103.76,64.33 104.32,64.89 v104.32,66.29 104.32,66.37 | v90.17,70.68 89.59,70.68 89.58,70.69
  Bottom 0.5: v115.31,59.47 115.31,58.61 115.75,58.17 119.43,58.17 119.77,58.51 v119.77,59.24 | v90.17,70.68 93.91,70.68 95.09,69.5 103.64,69.5 104.31,68.83 104.31,66.43 104.32,66.42 v104.32,66.29
N$3
  Top 0.5: R94.1 R96.3
N$5
  Top 0.5: R107.1 120.06,77.62 R99.2 119.66,77.62 | R98.2 119.66,77.62 | IC10.9 119.85,77.43 119.66,77.62
N$6
  Top 0.5: C38.- 34.61,61.08 R34.2 R29.1 | C35.+ R29.1 | R29.1
N$7
  Top 0.5: R107.2 R116.1 123.95,79.03 124.47,78.51 124.47,75.27 124.03,74.83 121.74,74.83 121.12,74.21 IC10.8
N$8
  Top 0.5: R102.2 R112.1 | R102.2 R100.2 116.95,77.6 R101.2 | IC10.13 114.77,74.91 114.08,75.6 R102.2
N$9
  Top 0.5: IC10.14 113.5,74.12 112.85,74.77 110.03,74.77 109.48,75.32 109.48,78.52 109.95,78.99 R119.1 | R119.1 R112.2 | R119.1
N$38
  Top 0.5: C6.- 27.85,44.64 R8.2 R3.1 29.54,42.89 C3.+
N$39
  Top 0.5: C16.- 27.86,47.91 R13.2 R8.1 C7.+
N$40
  Top 0.5: C20.- R18.2 R13.1 29.49,49.29 C17.+
N$41
  Top 0.5: C27.- R23.2 R18.1 27.9,52.54 C21.+
N$42
  Top 0.5: C32.- R27.2 R23.1 29.51,55.91 C28.+
N$43
  Top 0.5: C36.- R32.2 R27.1 29.47,59.35 C33.+
N$44
  Top 0.5: C41.- 27.78,64.34 R38.2 R32.1 C37.+
N$45
  Top 0.5: C7.- 29.61,44.66 R9.2 R4.1 C4.+
N$46
  Top 0.5: C17.- R14.2 R9.1 C8.+
N$47
  Top 0.5: C21.- R19.2 R14.1 32.96,49.35 C18.+
N$48
  Top 0.5: C28.- 31.28,54.47 R24.2 31.37,54.38 R19.1 32.95,52.54 C22.+
N$49
  Top 0.5: C33.- 31.29,58 R28.2 R24.1 31.35,55.8 C29.+
N$50
  Top 0.5: C37.- 31.25,61.14 R33.2 31.3,59.39 R28.1 C34.+
N$51
  Top 0.5: C42.- 29.56,64.26 R39.2 R33.1 C38.+
N$52
  Top 0.5: C5.+ R5.1 R10.2 C8.-
N$53
  Top 0.5: C18.- 34.6,47.99 R15.2 R10.1 C9.+
N$54
  Top 0.5: C22.- 34.61,51.17 R20.2 R15.1 36.39,49.32 C19.+
N$55
  Top 0.5: C29.- 34.63,54.4 R25.2 R20.1 36.35,52.52 C23.+
N$56
  Top 0.5: C34.- R29.2 R25.1 C30.+
N$58
  Top 0.5: C43.- R40.2 R34.1 36.32,62.42 C39.+
N$64
  Top 0.5: IC9.4 IC9.3 69.9,25.53 69.13,24.76 R85.1
N$68
  Top 0.5: R6.2 R1.1 C1.+
N$69
  Top 0.5: R11.2 28.51,22.75 27.16,21.4 22.96,21.4 | R6.1 23.64,17.71 22.96,18.39 22.96,21.4 | 22.96,21.4 C13.+
N$70
  Top 0.5: IC1.3 28.92,27.93 28.56,27.57 28.56,25.33 R11.1 C12.+
N$71
  Top 0.5: IC1.5 31.46,28.19 31.76,27.89 31.76,25.25 R30.1 33.35,25.23 C31.-
N$72  (via drill 0.35)
  Top 0.5: R16.1 C15.- | IC1.1 26.38,29.53 24.19,27.34 24.19,25.2 | 24.19,25.2 24.19,24.07 24.4,23.86 C15.- | C13.- 24.16,25.23 24.19,25.2 | C24.+ 28.52,20.82 v28.5,20.8 | C15.- 25.51,23.84 25.51,22.97 | 25.51,22.97 25.51,22.53 | v25.55,22.61 25.55,22.93 25.51,22.97
  Bottom 0.5: v25.55,22.61 25.55,21.24 25.99,20.8 v28.5,20.8
N$73
  Top 0.5: IC1.2 27.65,28.69 27.08,28.12 R16.2 C15.+
N$74
  Top 0.5: C24.- R21.1 35.27,19.42 C26.+
N$75
  Top 0.5: IC6.2 27.46,76.65 R47.1 R52.2
N$77
  Top 0.5: R46.2 C49.- 40.15,33.33 40.48,33.66 40.48,36.19 39.98,36.68 IC1.8 34,39.7 34.66,40.36 R5.2 | C3.- 31.53,41.54 | 31.53,41.54 34.59,41.54 R5.2 | R5.2 33.08,41.47 C4.- 31.55,41.52 | 31.55,41.52 31.53,41.54 | R4.2 31.55,41.52
N$114
  Top 0.5: R56.2 73.35,16.44 R61.2 R60.2 71.86,16.41 R59.2 R58.2 | C50.+ R68.3 | IC3.2 56.16,23.33 55.85,23.02 C50.+ | R56.2 58.04,16.44 54.89,19.59 C50.+ | R57.2 67.27,16.44 R56.2
N$115
  Top 0.5: C50.- IC3.1 52.44,30.1 R73.1 R79.1
N$117
  Top 0.5: 62.51,23.77 IC3.7 | 62.51,23.77 62.13,23.39 C53.- 62.71,23.39 | 62.71,23.39 62.89,23.39 | R85.2 63.78,23.39 63,23.39 62.89,23.39 | 62.51,23.77 62.51,23.59 62.71,23.39 | 62.51,23.77 62.89,23.39
N$118
  Top 0.5: IC6.6 R48.1 R53.2
N$119  (via drill 0.35)
  Top 0.5: R79.2 50.81,33.53 v50.78,33.5
  Bottom 0.5: IC9.2 63.9,30.02 63.25,29.37 51.64,29.37 50.75,30.26 50.75,33.51 50.76,33.5 v50.78,33.5
N$120
  Top 0.5: IC3.9 61.24,40.58 61.58,40.92 62.52,40.92 | IC9.6 69.9,39.91 68.89,40.92 C57.+ 62.52,40.92 | R93.1 62.52,40.92
N$121
  Top 0.5: R91.1 D5.C | D5.C | IC3.13 56.16,38.67 C54.+ 56.11,38.78 D5.C
N$122  (via drill 0.35)
  Top 0.5: C54.- 56.18,41.81 v56.13,41.86 | D5.A 55.6,42.39 55.95,42.03 v56.13,41.86 | Q1.B 46.04,42.74 45.73,42.44 45.73,36.33 46.74,35.32 54.87,35.32 IC3.14 | v56.14,41.86 v56.13,41.86
  Bottom 0.5: Q1.B 55.66,42.74 56.11,42.29 | 56.11,42.29 56.11,41.9 | v56.14,41.86 56.14,42.26 56.11,42.29
N$123
  Top 0.5: R94.2 R91.2 47.87,40.18 Q1.E
N$124
  Top 0.5: IC5.2 78.8,26.5 79.18,26.11 R92.1 R90.2 80.81,24.53 C56.+ 83.3,24.51 84.27,25.48 D6.C
N$125
  Top 0.5: R92.2 80.81,23.13 C56.- 85.22,23.11 86.25,24.15 86.25,33.09 85.68,33.67 D6.A 84.27,38.21 83.36,39.12 R95.1 | IC5.6 R95.1 | R95.1 76.94,39.12 76.05,40.01 Q2.E Q2.B
N$126
  Top 0.5: 80.2,61.98 D3.A 80.27,61.95 D4.C 83.03,61.93 R65.1 83.03,56.94 83.34,56.63 R75.1
N$127
  Top 0.5: IC8.3 R67.2 R72.2
N$129
  Top 0.5: R76.1 68.7,55.69 IC8.1
N$130
  Top 0.5: IC8.4 72.52,58.84 74.17,57.18 R77.1 75.61,55.7 R78.1 R74.2
N$132
  Top 0.5: IC1.9 32.73,35.15 33.16,34.72 R41.1 | C49.+ R41.1 | R46.1 R41.1
N$134
  Top 0.5: IC8.16 68.76,66.98 R88.1
N$135
  Top 0.5: IC8.14 71.25,69.39 70.22,70.41 R87.2 70.25,72.94 R86.2
N$137
  Top 0.5: IC8.13 72.52,69.31 73.18,69.97 73.18,72.89 R89.2
N$138
  Top 0.5: R62.2 R64.2 51.58,56.95 51.16,57.38 IC7.3
N$139
  Top 0.5: IC7.4 52.42,58.09 53.02,57.5 R63.2 55.89,55.54 R69.1 R70.1
N$141
  Top 0.5: IC7.1 48.62,55.56 R66.1
N$142
  Top 0.5: IC7.16 R83.1
N$144
  Top 0.5: IC7.13 52.42,69.91 53.03,70.51 R84.2
N$146
  Top 0.5: IC7.14 51.16,69.97 50.09,71.04 R81.2 R82.2
N$147
  Top 0.5: R55.1 62.52,61.73 | 62.52,61.73 D2.C | 62.52,61.73 59.99,61.73 D1.A 59.89,60.2 58.33,58.64 58.33,56.98 57.38,56.03 R71.1
N$149
  Top 0.5: R73.2 R68.2
N$151
  Top 0.5: R65.2 81.69,53.42 81.69,50.06 81.15,49.52 72.03,49.52 72.02,49.51 71.24,50.29 R67.1
N$152
  Top 0.5: R55.2 61.12,50.76 60.31,49.95 51.27,49.95 50.12,51.1 R62.1
N$153
  Top 0.5: R35.2 39.11,22.8 38.73,22.42 35.24,22.42 | 35.24,22.42 33.81,22.42 33.37,22.86 C31.+ | C26.- 35.25,22.41 35.24,22.42
N$154
  Top 0.5: C45.- 27.79,67.47 R43.2 R38.1 29.46,65.68 C42.+
N$155
  Top 0.5: IC6.9 32.54,89.83 R49.1 R54.2
N$156
  Top 0.5: C46.- R44.2 R39.1 C43.+
N$157
  Top 0.5: IC6.13 R50.1 R51.2
N$158
  Top 0.5: C40.+ R36.2 35,26.26 32.73,28.53 IC1.6
N$159
  Top 0.5: C47.- R45.2 34.63,65.69 R40.1 C44.+
N$162
  Top 0.5: R42.1 C45.+ 26.24,69.89 28.73,72.38 IC6.3
N$165
  Top 0.5: R43.1 29.41,68.82 C46.+ 29.47,70.21 31.27,72.01 IC6.5
N$166
  Top 0.5: R45.1 C48.+ 36.31,72.3 38.35,74.34 38.35,93.74 37.72,94.37 29.91,94.37 29.16,93.62 29.16,89.28 28.73,88.85 IC6.12
N$167
  Top 0.5: R44.1 C47.+ 32.9,70.95 37.31,75.36 37.31,92.55 36.65,93.21 31.72,93.21 31.27,92.76 IC6.10
N$175
  Top 0.5: U1.8 104.71,32.4 104.58,32.53 R108.2 R103.2 R97.2
N$177
  Top 0.5: C59.+ 101.66,12.08 101.66,14.32 102.16,14.82 106,14.82 106.47,15.29 106.47,38.52 106.01,38.98 102.29,38.98 101.68,38.37 R103.1
N$178
  Top 0.5: R114.2 R104.2 100.23,33.05 100.8,32.48 101.65,32.48 102.17,31.96 U1.10
N$179
  Top 0.5: 111.86,35.06 R105.2 113.27,35.04 R115.1 113.28,33.81 113.91,33.2 114.83,33.2 115.42,32.61 U2.10
N$180
  Top 0.5: R109.1 118.9,36.48 119.42,35.96 119.42,15.45 119.01,15.04 114.2,15.04 113.71,14.55 C60.-
N$181
  Top 0.5: 116.13,35.07 R113.1 | U2.8 117.96,32.96 117.61,33.31 R109.2 116.14,35.08 116.13,35.07 | R106.2 116.13,35.07
N$182
  Top 0.5: U2.5 115.42,19.68 R110.2
N$183
  Top 0.5: U1.5 102.17,20.52 R117.2
N$184
  Top 0.5: R118.2 98.31,19.13 97.98,19.46 97.98,21.68 98.36,22.06 U1.2
N$185
  Top 0.5: U2.2 111.61,21.14 111.17,20.7 111.17,18.69 111.58,18.28 R111.2
N$186
  Top 0.5: U2.3 112.88,19.7 R111.1
N$187
  Top 0.5: U1.3 R118.1
N$188  (via drill 0.35)
  Top 0.5: U1.6 103.44,22.47 103.59,22.32 R120.1 104.77,20.5 105.24,20.03 105.24,16.51 104.85,16.12 96.73,16.16 96.3,16.16 94.87,17.59 94.87,32.62 94.16,33.33 v92.86,33.33 | v92.86,36.85 92.84,36.83 | 92.84,36.83 92.84,36.77 | C62.+ 94.66,41.99 92.84,40.17 92.84,36.83
  Bottom 0.5: v92.86,36.85 v92.86,33.33
N$189
  Top 0.5: U1.12 99.63,31.77 98.97,32.43 97.75,32.43 97.32,32.86 R122.1 92.76,34.82 90.96,36.62 C64.+
N$190  (via drill 0.35)
  Top 0.5: R124.1 97.81,76.47 | 97.81,76.47 97.82,76.48 | v97.8,76.55 v97.81,76.54 97.81,76.47 | v100.59,51.57 C62.-
  Bottom 0.5: v97.8,76.55 97.8,77.33 98.3,77.83 107.58,77.83 108.61,76.8 108.61,52.35 107.89,51.63 100.64,51.63 v100.59,51.58 v100.59,51.57
N$191  (via drill 0.35)
  Top 0.5: R125.1 99.25,76.57 | 99.25,76.57 99.25,76.6 99.26,76.61 | v99.28,76.6 99.25,76.57 | v91.05,51.86 91.05,48.13 C64.-
  Bottom 0.5: v99.28,76.6 106.62,76.6 107.44,75.78 107.44,54.16 106.5,53.22 99.98,53.22 98.62,51.86 v91.05,51.86
N$192
  Top 0.5: R128.2 R124.2 97.81,71.52 97.28,70.99 IC4.10
N$193  (via drill 0.35)
  Top 0.5: U2.6 116.69,22.43 116.84,22.28 R121.1 118.17,19.67 118.18,19.68 v118.2,19.68 | C63.+ 120.14,37.73 121.66,36.21 121.66,20.06 121.25,19.65 v121.11,19.65
  Bottom 0.5: v118.2,19.68 121.08,19.68 v121.11,19.65
N$194
  Top 0.5: U2.12 112.88,31.99 112.42,32.45 110.79,32.45 110.39,32.85 R123.1 108.92,35.03 108.18,35.77 108.18,41.32 108.76,41.9 C65.+
N$195  (via drill 0.35)
  Top 0.5: v94.73,76.62 R126.1 | v120.15,51.64 C63.-
  Bottom 0.5: v94.73,76.62 94.73,78.16 95.66,79.09 108.81,79.09 109.84,78.06 109.84,56.06 110.74,55.16 119.16,55.16 120.13,54.19 120.13,51.74 120.15,51.72 v120.15,51.64
N$196  (via drill 0.35)
  Top 0.5: v91.89,76.59 91.86,76.56 R127.1 | v110.33,51.5 110.33,47.92 C65.-
  Bottom 0.5: v91.89,76.59 91.89,74.92 92.51,74.3 105.48,74.3 106.2,73.58 106.2,55.5 105.3,54.6 99.64,54.6 98.29,53.25 96.49,53.25 96.47,53.27 88.41,53.27 87.5,52.36 87.5,46.23 88.27,45.46 109.96,45.46 110.34,45.84 v110.34,51.49 v110.33,51.5
N$197
  Top 0.5: R126.2 R129.2 93.3,72.21 94.74,70.77 IC4.12
N$199
  Top 0.5: R125.2 | R125.2 R130.1 | IC4.9 98.55,70.42 99.29,71.16 99.29,73.22 R125.2
N$200
  Top 0.5: R131.1 R127.2 91.86,72.12 93.47,70.51 IC4.13
N$201
  Top 0.5: R144.1 81.76,85.01 83.22,83.55 99.72,83.55 100.7,82.57 R130.2 101.94,74.65 102.42,74.17 102.42,70.98 | IC4.8 99.82,70.11 100.32,70.61 102.05,70.61 | 102.05,70.61 102.42,70.98 | R132.2 R133.2 104.01,52.91 102.42,54.5 102.42,70.06 102.42,70.24 | 102.42,70.24 102.42,70.98 | 102.05,70.61 102.42,70.24
N$202
  Top 0.5: R138.2 R134.2 | R134.2 | IC10.5 118.58,64.76 118.27,64.45 118.27,62.52 R134.2
N$204
  Top 0.5: C67.+ 112.44,62.5 | R137.2 113.95,62.5 113.88,62.5 | R137.2 | IC10.2 114.77,65.53 115.31,64.99 R137.2 | R140.1 112.44,62.5 | 112.44,62.5 113.88,62.5 | R136.2 113.88,62.5
N$205
  Top 0.5: R136.1 113.86,57.33 R133.1
N$207
  Top 0.5: R139.1 121.54,62.46 | 121.54,62.46 R135.2 119.85,62.54 | IC10.6 119.85,62.54 | 119.85,62.54 121.46,62.54 | 121.46,62.54 121.54,62.46 | C66.+ 121.42,62.5 121.46,62.54
N$208  (via drill 0.35)
  Top 0.5: C66.- 122.93,61.1 R139.2 124.18,61.06 124.46,61.34 124.46,64.84 | IC10.7 121.12,65.75 121.45,65.42 123.99,65.42 124.46,64.95 124.46,64.92 | 124.46,64.92 124.46,64.84 | 124.46,64.84 v124.42,64.88 124.46,64.92 | R143.1 83.24,86.78 83.92,86.1 v103.79,86.1
  Bottom 0.5: 124.42,64.84 v124.42,64.88 124.42,83.51 122.58,85.35 122.35,85.58 121.83,86.1 v103.79,86.1
S0
  Top 0.5: IC6.1 26.19,78.83 24.55,77.19 24.55,75.38 24.7,75.23 R52.1
S90
  Top 0.5: IC6.7 33.81,79.13 35.45,77.49 35.45,75.52 35.17,75.24 R53.1
S180
  Top 0.5: IC6.8 33.81,87.17 35.39,88.75 35.39,90.97 35.1,91.26 R54.1
S270
  Top 0.5: IC6.14 26.19,86.99 24.65,88.53 24.65,90.89 24.96,91.2 R51.1
TO_U  (via drill 0.35)
  Top 0.5: R75.2 93.05,58.13 93.05,60.39 93.47,60.81 IC4.2 IC4.1 92.09,63.31 v90.83,63.31 | R70.2 54.47,52.67 55.41,51.73 55.44,51.76 59.29,51.76 59.31,51.74 v59.41,51.74 | v74.23,52.77 74.23,54.24 R77.2 | R86.1 71.68,75.51 71.05,76.14 | 71.05,76.14 66.63,76.14 65.89,75.4 65.89,51.8 | 65.91,51.75 65.89,51.77 65.89,51.8 | v65.94,51.75 65.89,51.8 | 71.05,76.14 73.87,76.14 75.41,74.6 85.92,74.6 86.99,73.53 86.99,71.34 89.37,68.96 90.27,68.96 90.26,68.95 v90.23,68.95
  Bottom 0.5: v59.41,51.74 65.16,51.74 | 65.16,51.74 73.87,51.74 74.19,52.06 74.19,52.67 74.23,52.71 v74.23,52.77 | v65.94,51.75 65.17,51.75 65.16,51.74 | v90.23,68.95 90.23,63.88 90.7,63.41 90.73,63.41 v90.83,63.31
TOT  (via drill 0.35)
  Top 0.5: R81.1 50.09,75.11 50.58,75.6 63.53,75.61 64.45,74.69 64.45,68.05 | 64.45,68.05 64.45,67.55 | IC4.6 IC4.7 99.82,61.12 | R69.2 R71.2 57.42,54.12 58.84,54.12 60.03,55.31 63.4,55.32 64.45,56.37 64.45,67.55 | 64.45,68.05 64.49,68.01 v64.49,67.68 64.49,67.59 64.45,67.55 | 99.82,61.12 99.86,61.08 | v99.88,61.04 99.82,61.1 99.82,61.12 | v83.35,68.39 87.87,68.39 v87.92,68.34
  Bottom 0.5: v64.49,67.68 80.38,67.67 81.06,68.35 82.51,68.35 | 82.51,68.35 83.29,68.35 | v99.88,61.04 99.29,61.63 88.82,61.63 87.89,62.56 87.89,68.31 v87.92,68.34 | v83.35,68.39 82.55,68.39 82.51,68.35
VEE  (via drill 0.35)
  Top 0.5: U2.14 108.13,29.96 107.77,29.6 107.77,28.22 107.78,28.22 v107.8,28.2 | U1.14 97.09,27.98 97.65,27.42 97.65,27.4 v97.67,27.38
  Bottom 0.5: v97.67,27.38 107.36,27.38 107.8,27.82 v107.8,28.2